# EAGLE design ScouseTom_CS_Shield (EAGLE 9.4.2)

## Sheet 1 of 5: Arduino
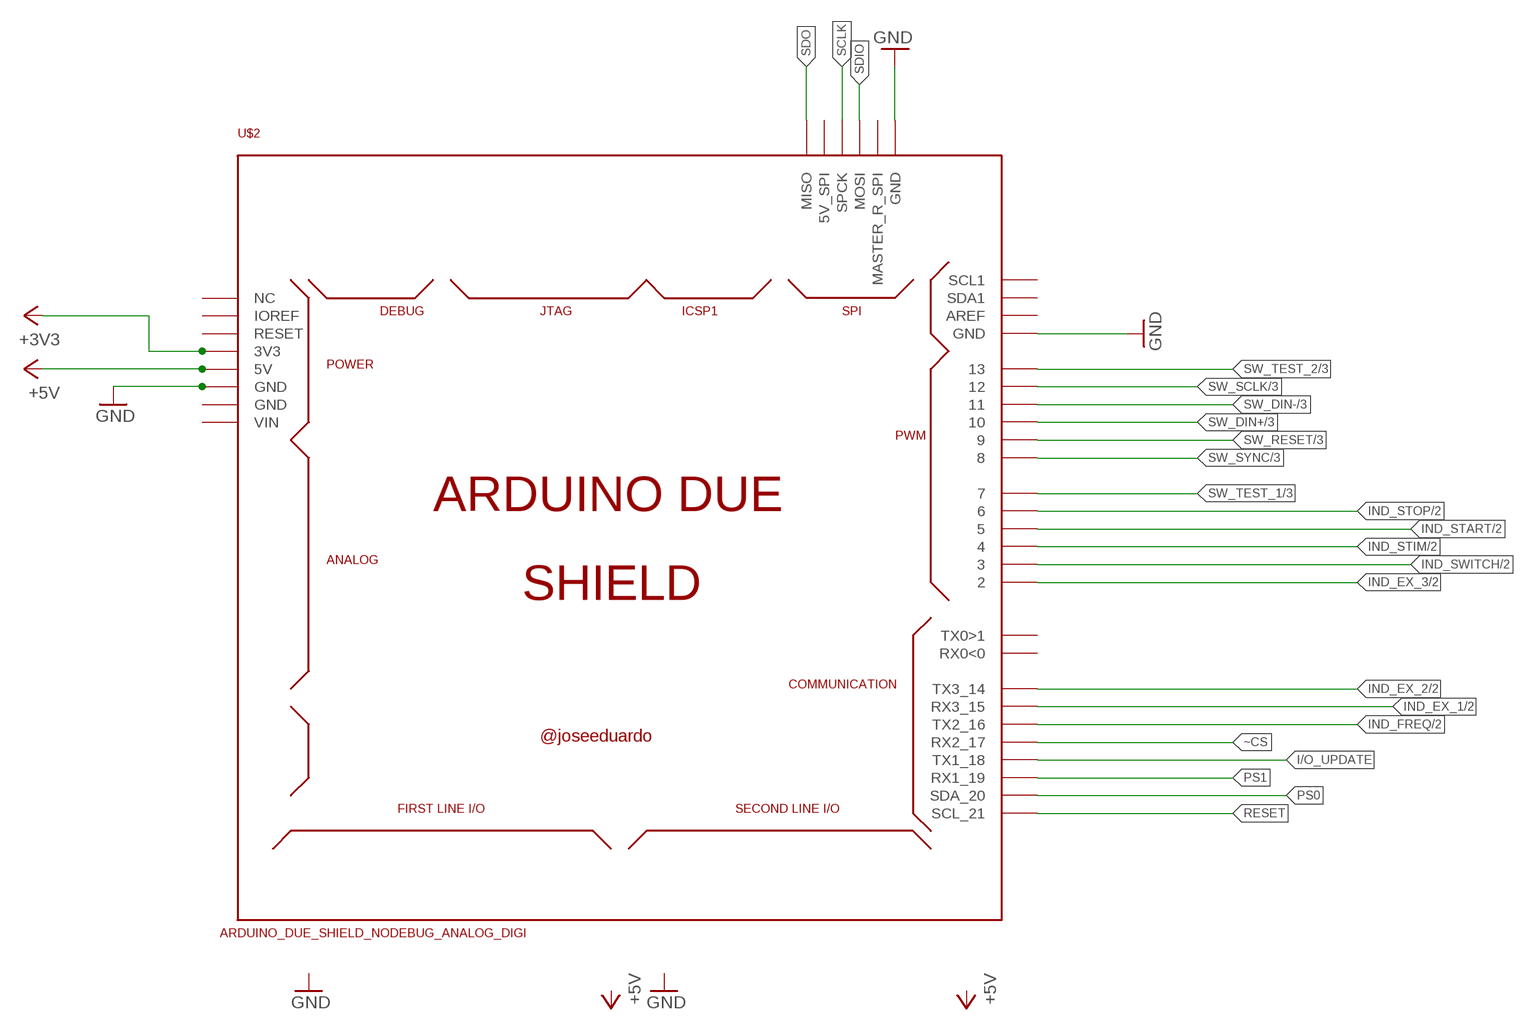
[diagram p0: schematic, sheet 1]

### Parts
U$2  ARDUINO_DUE_SHIELD_NODEBUG_ANALOG_DIGI  [ARDUINO_DUE_SHIELD_NODEBUG_ANALOG_DIG]

### Nets
+3V3: U$2.3V3 ; also sheet 4,5
+5V: U$2.5V0(5V) ; also sheet 2,3
GND: U$2.GND U$2.GND_4(GND) U$2.GND_5(GND) ; also sheet 2,3,4,5
I/O_UPDATE: U$2.18(TX1_18) ; also sheet 5
IND_EX_1: U$2.15(RX3_15) ; also sheet 2
IND_EX_2: U$2.14(TX3_14) ; also sheet 2
IND_EX_3: U$2.2 ; also sheet 2
IND_FREQ: U$2.16(TX2_16) ; also sheet 2
IND_START: U$2.5 ; also sheet 2
IND_STIM: U$2.4 ; also sheet 2
IND_STOP: U$2.6 ; also sheet 2
IND_SWITCH: U$2.3 ; also sheet 2
PS0: U$2.20(SDA_20) ; also sheet 5
PS1: U$2.19(RX1_19) ; also sheet 5
RESET: U$2.21(SCL_21) ; also sheet 5
SCLK: U$2.SPCK ; also sheet 4,5
SDIO: U$2.MOSI ; also sheet 4,5
SDO: U$2.MISO ; also sheet 4,5
SW_DIN+: U$2.10 ; also sheet 3
SW_DIN-: U$2.11 ; also sheet 3
SW_RESET: U$2.9 ; also sheet 3
SW_SCLK: U$2.12 ; also sheet 3
SW_SYNC: U$2.8 ; also sheet 3
SW_TEST_1: U$2.7 ; also sheet 3
SW_TEST_2: U$2.13 ; also sheet 3
~CS: U$2.17(RX2_17) ; also sheet 5
Unconnected: U$2.0(RX0<0) U$2.1(TX0>1) U$2.5V_2(5V_SPI) U$2.AREF U$2.GND_1(GND) U$2.IOREF U$2.MASTER_RESET_SPI(MASTER_R_SPI) U$2.NC_2(NC) U$2.RESET U$2.SCL1 U$2.SDA1 U$2.VIN

## Sheet 2 of 5: Indicators
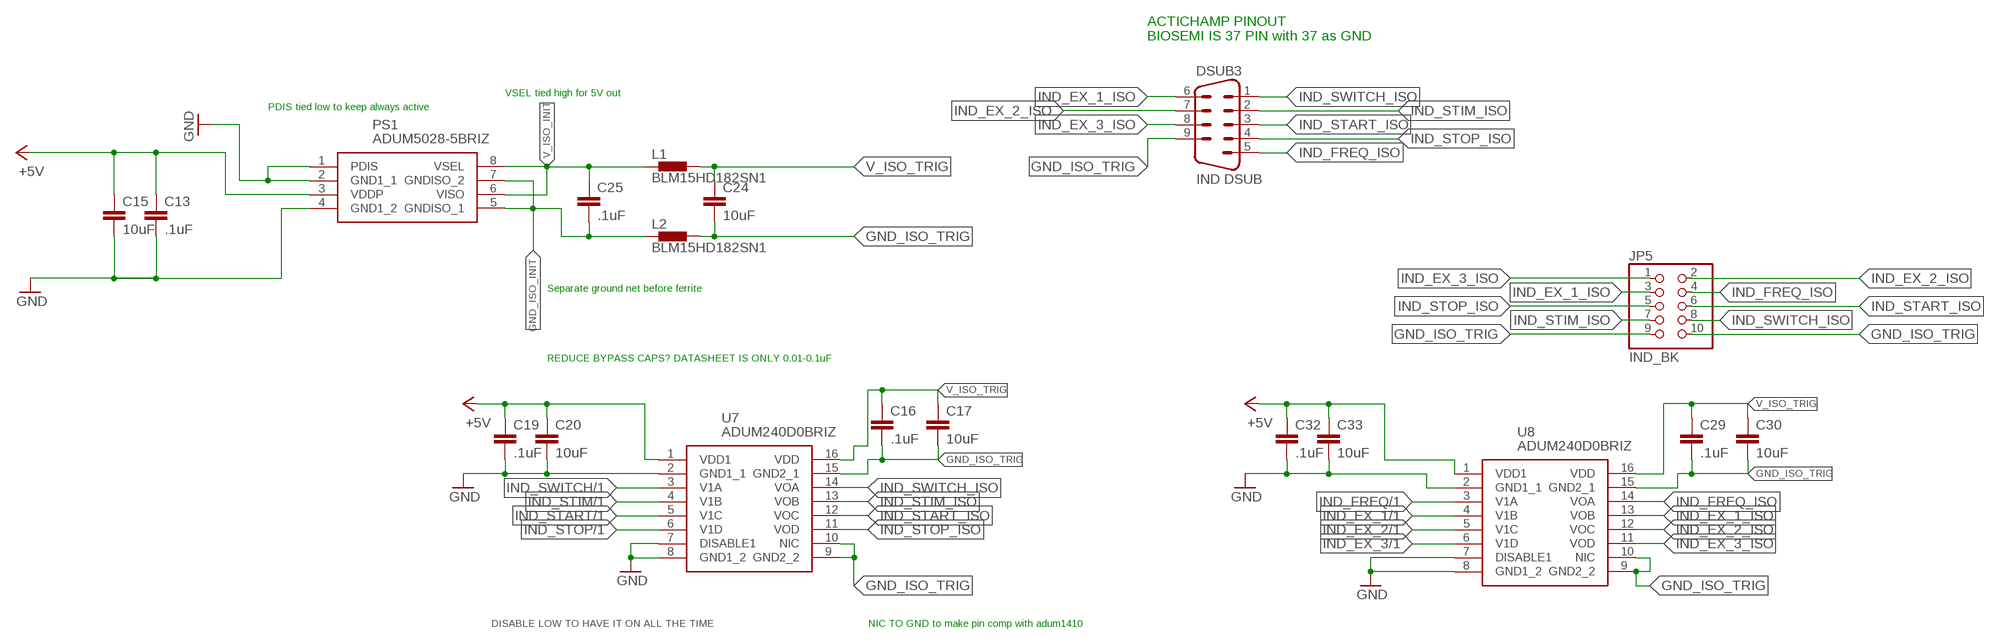
[diagram p1: schematic, sheet 2]

### Parts
C13  .1uF  C-EUC0603  [C0603]
C15  10uF  C-EUC0603  [C0603]
C16  .1uF  C-EUC0603  [C0603]
C17  10uF  C-EUC0603  [C0603]
C19  .1uF  C-EUC0603  [C0603]
C20  10uF  C-EUC0603  [C0603]
C24  10uF  C-EUC0603  [C0603]
C25  .1uF  C-EUC0603  [C0603]
C29  .1uF  C-EUC0603  [C0603]
C30  10uF  C-EUC0603  [C0603]
C32  .1uF  C-EUC0603  [C0603]
C33  10uF  C-EUC0603  [C0603]
DSUB3  IND DSUB  DSUB9RA  [DSUB9]
JP5  IND_BK  PINHD-2X5  [2X05]
L1  BLM15HD182SN1  [0402]
L2  BLM15HD182SN1  [0402]
PS1  ADUM5028-5BRIZ  [SOIC127P1031X265-8N]
U7  ADUM240D0BRIZ  [SOIC127P1032X265-16N]
U8  ADUM240D0BRIZ  [SOIC127P1032X265-16N]

### Nets
+5V: C13.1 C15.1 C19.1 C20.1 C32.1 C33.1 PS1.3(VDDP) U7.1(VDD1) U8.1(VDD1) ; also sheet 1,3
GND: C13.2 C15.2 C19.2 C20.2 C32.2 C33.2 PS1.1(PDIS) PS1.2(GND1_1) PS1.4(GND1_2) U7.2(GND1_1) U7.7(DISABLE1) U7.8(GND1_2) U8.2(GND1_1) U8.7(DISABLE1) U8.8(GND1_2) ; also sheet 1,3,4,5
GND_ISO_INIT: C25.2 L2.1 PS1.5(GNDISO_1) PS1.7(GNDISO_2)
GND_ISO_TRIG: C16.2 C17.2 C24.2 C29.2 C30.2 DSUB3.9 JP5.9 JP5.10 L2.2 U7.9(GND2_2) U7.10(NIC) U7.15(GND2_1) U8.9(GND2_2) U8.10(NIC) U8.15(GND2_1)
IND_EX_1: U8.4(V1B) ; also sheet 1
IND_EX_1_ISO: DSUB3.6 JP5.3 U8.13(VOB)
IND_EX_2: U8.5(V1C) ; also sheet 1
IND_EX_2_ISO: DSUB3.7 JP5.2 U8.12(VOC)
IND_EX_3: U8.6(V1D) ; also sheet 1
IND_EX_3_ISO: DSUB3.8 JP5.1 U8.11(VOD)
IND_FREQ: U8.3(V1A) ; also sheet 1
IND_FREQ_ISO: DSUB3.5 JP5.4 U8.14(VOA)
IND_START: U7.5(V1C) ; also sheet 1
IND_START_ISO: DSUB3.3 JP5.6 U7.12(VOC)
IND_STIM: U7.4(V1B) ; also sheet 1
IND_STIM_ISO: DSUB3.2 JP5.7 U7.13(VOB)
IND_STOP: U7.6(V1D) ; also sheet 1
IND_STOP_ISO: DSUB3.4 JP5.5 U7.11(VOD)
IND_SWITCH: U7.3(V1A) ; also sheet 1
IND_SWITCH_ISO: DSUB3.1 JP5.8 U7.14(VOA)
V_ISO_INIT: C25.1 L1.1 PS1.6(VISO) PS1.8(VSEL)
V_ISO_TRIG: C16.1 C17.1 C24.1 C29.1 C30.1 L1.2 U7.16(VDD) U8.16(VDD)

### Notes on the sheet
- ACTICHAMP PINOUT
  BIOSEMI IS 37 PIN with 37 as GND
- VSEL tied high for 5V out
- PDIS tied low to keep always active
- Separate ground net before ferrite
- REDUCE BYPASS CAPS? DATASHEET IS ONLY 0.01-0.1uF
- DISABLE LOW TO HAVE IT ON ALL THE TIME | NIC TO GND to make pin comp with adum1410

## Sheet 3 of 5: Switch
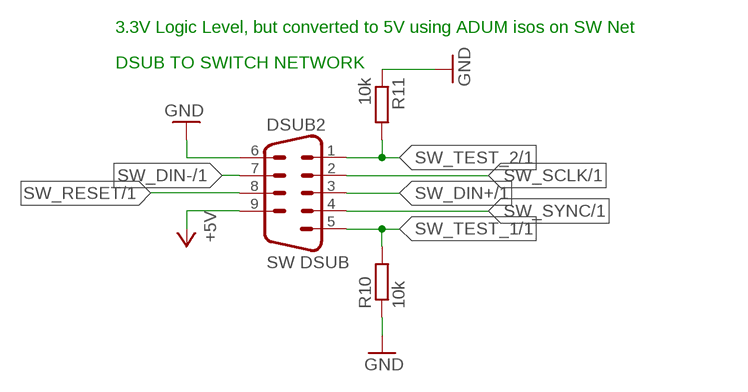
[diagram p2: schematic, sheet 3]

### Parts
DSUB2  SW DSUB  DSUB9RA  [DSUB9]
R10  10k  R-EU_R0805  [R0805]
R11  10k  R-EU_R0805  [R0805]

### Nets
+5V: DSUB2.9 ; also sheet 1,2
GND: DSUB2.6 R10.1 R11.1 ; also sheet 1,2,4,5
SW_DIN+: DSUB2.3 ; also sheet 1
SW_DIN-: DSUB2.7 ; also sheet 1
SW_RESET: DSUB2.8 ; also sheet 1
SW_SCLK: DSUB2.2 ; also sheet 1
SW_SYNC: DSUB2.4 ; also sheet 1
SW_TEST_1: DSUB2.5 R10.2 ; also sheet 1
SW_TEST_2: DSUB2.1 R11.2 ; also sheet 1

### Notes on the sheet
- 3.3V Logic Level, but converted to 5V using ADUM isos on SW Net
- DSUB TO SWITCH NETWORK

## Sheet 4 of 5: AD99554 Power and Clock
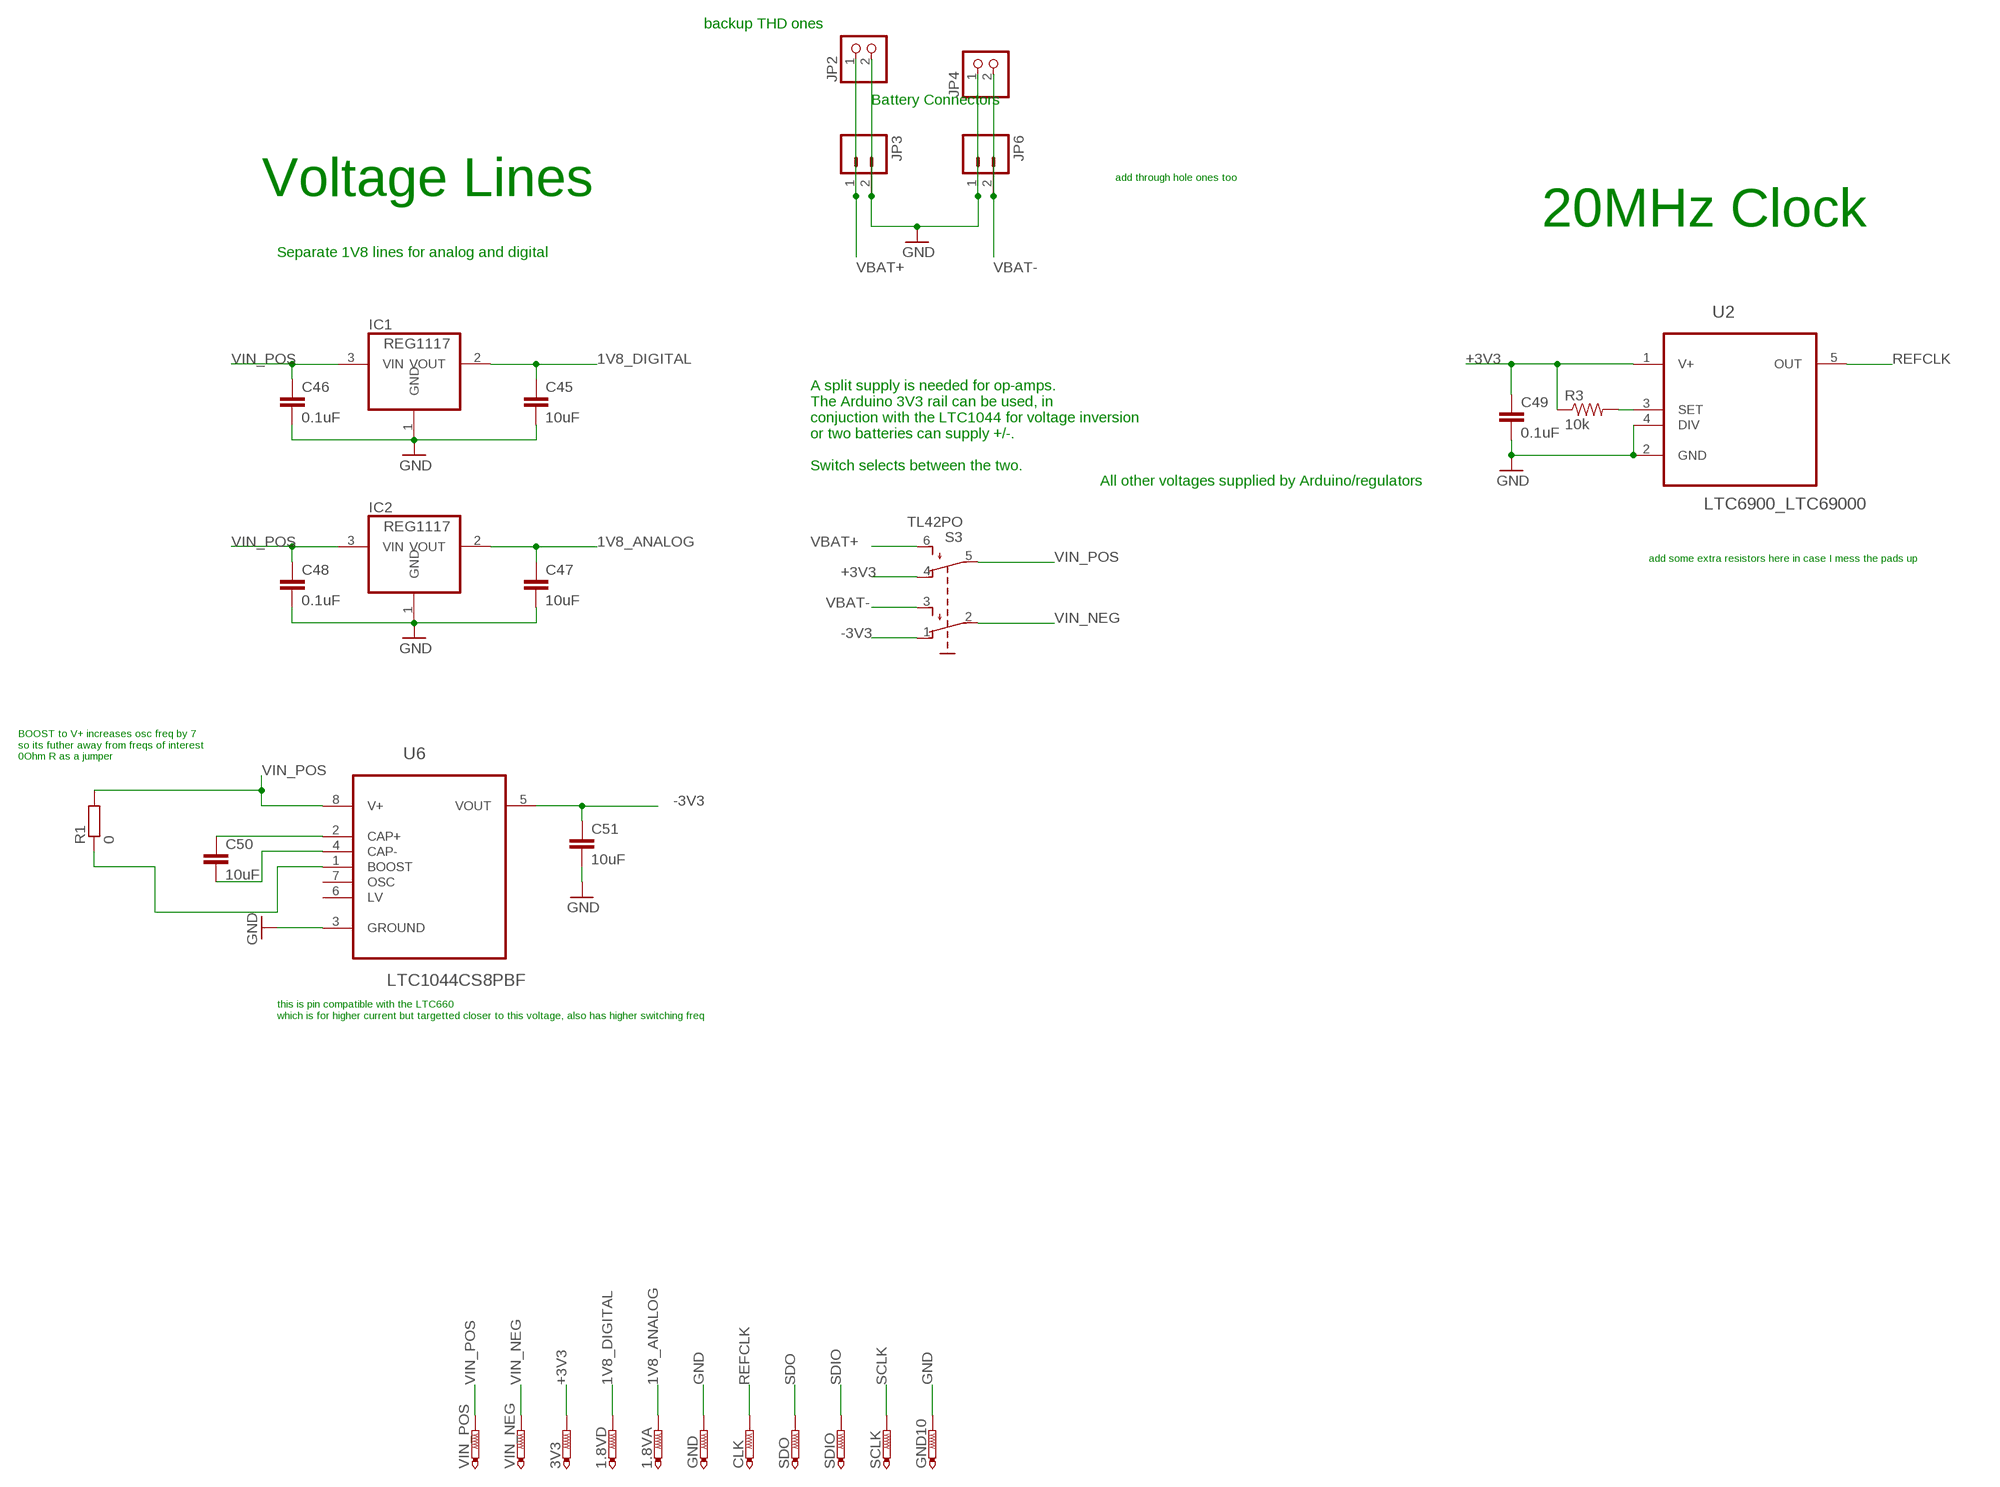
[diagram p3: schematic, sheet 4]

### Parts
1.8VA  PTR1PAD1-13  [P1-13]
1.8VD  PTR1PAD1-13  [P1-13]
3V3  PTR1PAD1-13  [P1-13]
C45  10uF  C-EUC0603  [C0603]
C46  0.1uF  C-EUC0603  [C0603]
C47  10uF  C-EUC0603  [C0603]
C48  0.1uF  C-EUC0603  [C0603]
C49  0.1uF  C-EUC0603  [C0603]
C50  10uF  C-EUC0603  [C0603]
C51  10uF  C-EUC0603  [C0603]
CLK  PTR1PAD1-13  [P1-13]
GND  PTR1PAD1-13  [P1-13]
GND10  PTR1PAD1-13  [P1-13]
IC1  REG1117  [SOT223]
IC2  REG1117  [SOT223]
JP2  PINHD-1X2  [1X02]
JP3  M02-JST-2MM-SMT  [JST-2-SMD]
JP4  PINHD-1X2  [1X02]
JP6  M02-JST-2MM-SMT  [JST-2-SMD]
R1  0  R-EU_R0805  [R0805]
R3  10k  R-US_R0805  [R0805]
S3  TL42PO  [TL4XPO]
SCLK  PTR1PAD1-13  [P1-13]
SDIO  PTR1PAD1-13  [P1-13]
SDO  PTR1PAD1-13  [P1-13]
U2  LTC6900_LTC69000  [LTC6900_SOT23-5L]
U6  LTC1044CS8PBF  [SOIC127P600X175-8N]
VIN_NEG  PTR1PAD1-13  [P1-13]
VIN_POS  PTR1PAD1-13  [P1-13]

### Nets
1V8_ANALOG: 1.8VA.TP C47.1 IC2.2(VOUT) ; also sheet 5
1V8_DIGITAL: 1.8VD.TP C45.1 IC1.2(VOUT) ; also sheet 5
+3V3: 3V3.TP C49.1 R3.1 S3.4(O1) U2.1(V+) ; also sheet 1,5
-3V3: C51.1 S3.1(O) U6.5(VOUT)
GND: C45.2 C46.2 C47.2 C48.2 C49.2 C51.2 GND10.TP GND.TP IC1.1(GND) IC2.1(GND) JP2.2 JP3.2 JP4.1 JP6.1 U2.2(GND) U2.4(DIV) U6.3(GROUND) ; also sheet 1,2,3,5
N$3: R1.1 U6.1(BOOST)
N$12: C50.1 U6.2(CAP+)
N$13: R3.2 U2.3(SET)
N$14: C50.2 U6.4(CAP-)
REFCLK: CLK.TP U2.5(OUT) ; also sheet 5
SCLK: SCLK.TP ; also sheet 1,5
SDIO: SDIO.TP ; also sheet 1,5
SDO: SDO.TP ; also sheet 1,5
VBAT+: JP2.1 JP3.1 S3.6(S1)
VBAT-: JP4.2 JP6.2 S3.3(S)
VIN_NEG: S3.2(P) VIN_NEG.TP ; also sheet 5
VIN_POS: C46.1 C48.1 IC1.3(VIN) IC2.3(VIN) R1.2 S3.5(P1) U6.8(V+) VIN_POS.TP ; also sheet 5
Unconnected: U6.6(LV) U6.7(OSC)

### Notes on the sheet
- backup THD ones
- Battery Connectors
- add through hole ones too
- Voltage Lines
- 20MHz Clock
- Separate 1V8 lines for analog and digital
- A split supply is needed for op-amps.
  The Arduino 3V3 rail can be used, in 
  conjuction with the LTC1044 for voltage inversion
  or two batteries can supply +/-.
  
  Switch selects between the two.
- All other voltages supplied by Arduino/regulators
- add some extra resistors here in case I mess the pads up
- BOOST to V+ increases osc freq by 7
  so its futher away from freqs of interest
  0Ohm R as a jumper
- this is pin compatible with the LTC660
  which is for higher current but targetted closer to this voltage, also has higher switching freq

## Sheet 5 of 5: DAC and HCP
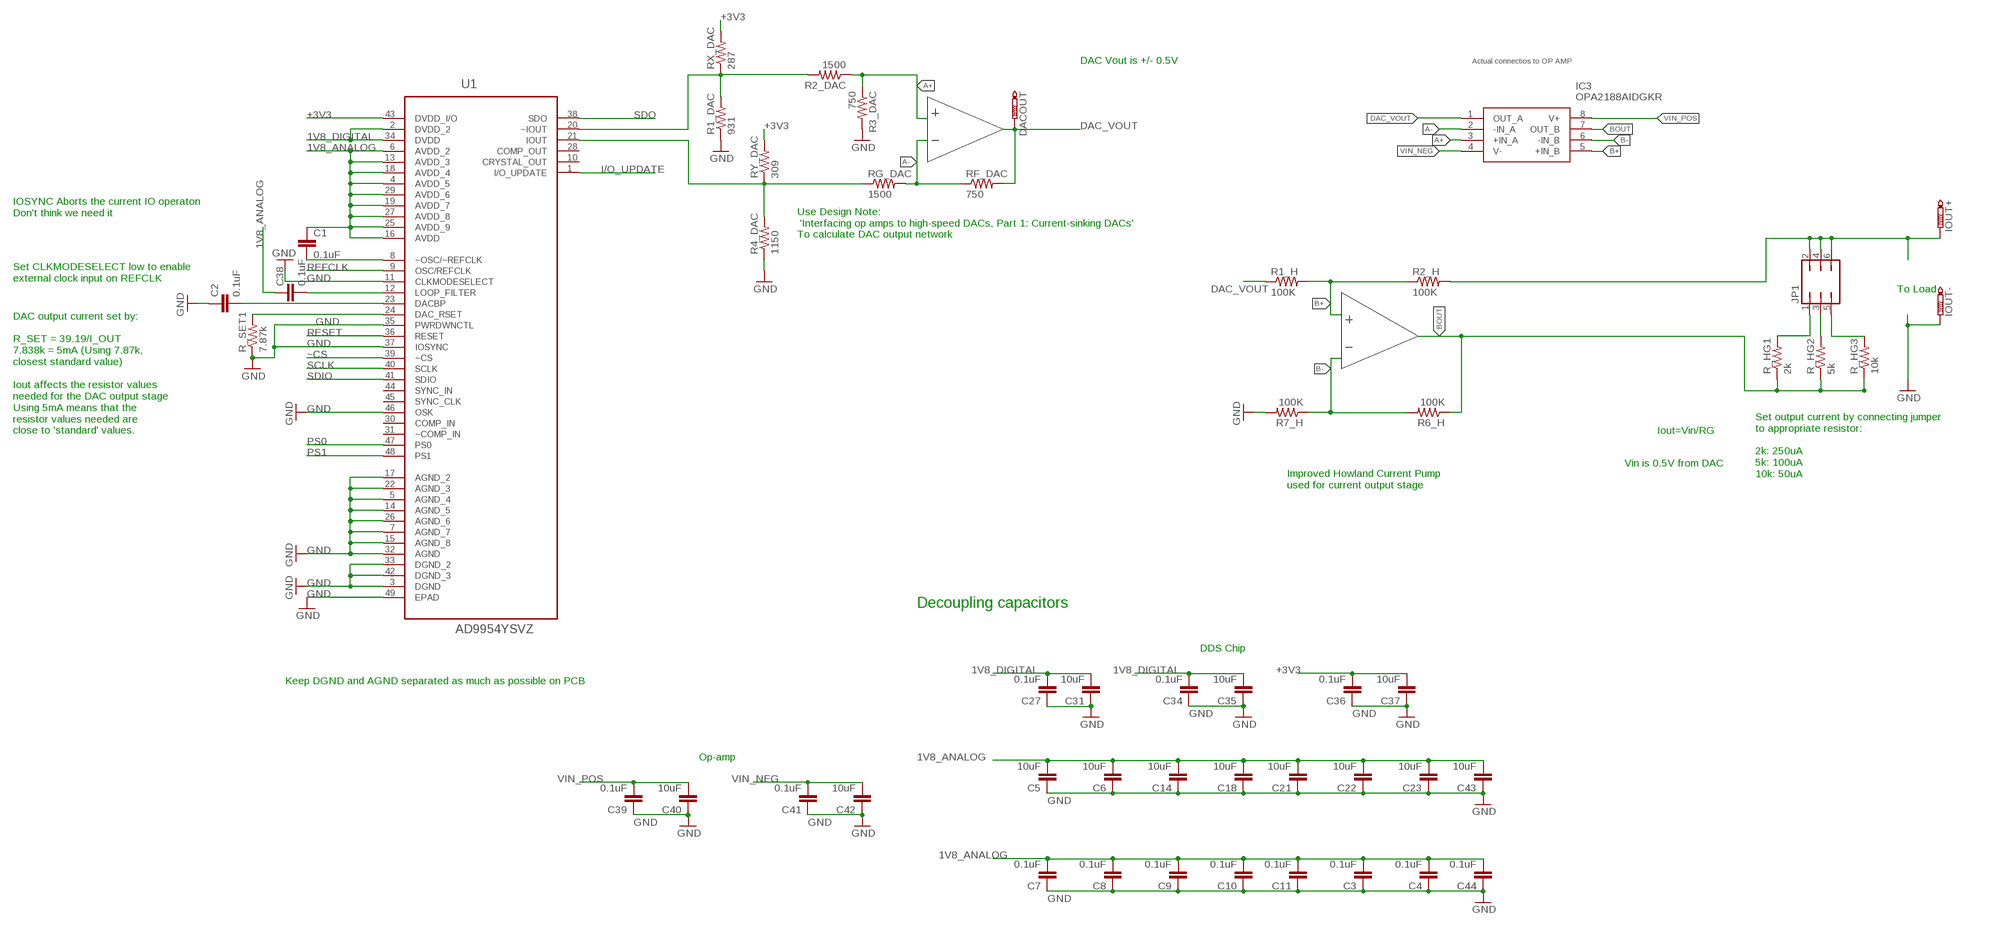
[diagram p4: schematic, sheet 5]

### Parts
C1  0.1uF  C-EUC0603  [C0603]
C2  0.1uF  C-EUC0603  [C0603]
C3  0.1uF  C-EUC0603  [C0603]
C4  0.1uF  C-EUC0603  [C0603]
C5  10uF  C-EUC0603  [C0603]
C6  10uF  C-EUC0603  [C0603]
C7  0.1uF  C-EUC0603  [C0603]
C8  0.1uF  C-EUC0603  [C0603]
C9  0.1uF  C-EUC0603  [C0603]
C10  0.1uF  C-EUC0603  [C0603]
C11  0.1uF  C-EUC0603  [C0603]
C14  10uF  C-EUC0603  [C0603]
C18  10uF  C-EUC0603  [C0603]
C21  10uF  C-EUC0603  [C0603]
C22  10uF  C-EUC0603  [C0603]
C23  10uF  C-EUC0603  [C0603]
C27  0.1uF  C-EUC0603  [C0603]
C31  10uF  C-EUC0603  [C0603]
C34  0.1uF  C-EUC0603  [C0603]
C35  10uF  C-EUC0603  [C0603]
C36  0.1uF  C-EUC0603  [C0603]
C37  10uF  C-EUC0603  [C0603]
C38  0.1uF  C-EUC0603  [C0603]
C39  0.1uF  C-EUC0603  [C0603]
C40  10uF  C-EUC0603  [C0603]
C41  0.1uF  C-EUC0603  [C0603]
C42  10uF  C-EUC0603  [C0603]
C43  10uF  C-EUC0603  [C0603]
C44  0.1uF  C-EUC0603  [C0603]
DACOUT  PTR1PAD1-13  [P1-13]
IC3  OPA2188AIDGKR  [SOP65P490X110-8N]
IOUT+  PTR1PAD1-13  [P1-13]
IOUT-  PTR1PAD1-13  [P1-13]
JP1  JP3Q  [JP3Q]
R1_DAC  931  R-US_R0805  [R0805]
R1_H  100K  R-US_R0805  [R0805]
R2_DAC  1500  R-US_R0805  [R0805]
R2_H  100K  R-US_R0805  [R0805]
R3_DAC  750  R-US_R0805  [R0805]
R4_DAC  1150  R-US_R0805  [R0805]
R6_H  100K  R-US_R0805  [R0805]
R7_H  100K  R-US_R0805  [R0805]
R_HG1  2k  R-US_R0805  [R0805]
R_HG2  5k  R-US_R0805  [R0805]
R_HG3  10k  R-US_R0805  [R0805]
R_SET1  7.87k  R-US_R0805  [R0805]
RF_DAC  750  R-US_R0805  [R0805]
RG_DAC  1500  R-US_R0805  [R0805]
RX_DAC  287  R-US_R0805  [R0805]
RY_DAC  309  R-US_R0805  [R0805]
U1  AD9954YSVZ  [QFP50P900X900X120-49N]

### Nets
1V8_ANALOG: C1.1 C3.2 C4.2 C5.2 C6.2 C7.2 C8.2 C9.2 C10.2 C11.2 C14.2 C18.2 C21.2 C22.2 C23.2 C38.1 C43.2 C44.2 U1.4(AVDD_5) U1.6(AVDD_2) U1.13(AVDD_3) U1.16(AVDD) U1.18(AVDD_4) U1.19(AVDD_7) U1.25(AVDD_9) U1.27(AVDD_8) U1.29(AVDD_6) ; also sheet 4
1V8_DIGITAL: C27.2 C31.2 C34.2 C35.2 U1.2(DVDD_2) U1.34(DVDD) ; also sheet 4
+3V3: C36.2 C37.2 RX_DAC.2 RY_DAC.2 U1.43(DVDD_I/O) ; also sheet 1,4
A+: IC3.3(+IN_A) R2_DAC.1 R3_DAC.1
A-: IC3.2(-IN_A) RF_DAC.1 RG_DAC.2
B+: IC3.5(+IN_B) R1_H.2 R2_H.1
B-: IC3.6(-IN_B) R6_H.2 R7_H.1
BOUT: IC3.7(OUT_B) R6_H.1 R_HG1.1 R_HG2.1 R_HG3.1
DAC_VOUT: DACOUT.TP IC3.1(OUT_A) R1_H.1 RF_DAC.2
GND: C2.1 C3.1 C4.1 C5.1 C6.1 C7.1 C8.1 C9.1 C10.1 C11.1 C14.1 C18.1 C21.1 C22.1 C23.1 C27.1 C31.1 C34.1 C35.1 C36.1 C37.1 C39.1 C40.1 C41.1 C42.1 C43.1 C44.1 IOUT-.TP R1_DAC.1 R3_DAC.2 R4_DAC.1 R7_H.2 R_SET1.1 U1.3(DGND) U1.5(AGND_4) U1.7(AGND_7) U1.11(CLKMODESELECT) U1.14(AGND_5) U1.15(AGND_8) U1.17(AGND_2) U1.22(AGND_3) U1.26(AGND_6) U1.32(AGND) U1.33(DGND_2) U1.35(PWRDWNCTL) U1.37(IOSYNC) U1.42(DGND_3) U1.46(OSK) U1.49(EPAD) ; also sheet 1,2,3,4
I/O_UPDATE: U1.1(I/O_UPDATE) ; also sheet 1
IOUT: R4_DAC.2 RG_DAC.1 RY_DAC.1 U1.21(IOUT)
N$1: C2.2 U1.23(DACBP)
N$2: C1.2 U1.8(~OSC/~REFCLK)
N$4: R_SET1.2 U1.24(DAC_RSET)
N$10: C38.2 U1.12(LOOP_FILTER)
N$11: IOUT+.TP JP1.2 JP1.4 JP1.6 R2_H.2
N$18: JP1.3 R_HG2.2
N$20: JP1.5 R_HG3.2
N$21: JP1.1 R_HG1.2
PS0: U1.47(PS0) ; also sheet 1
PS1: U1.48(PS1) ; also sheet 1
REFCLK: U1.9(OSC/REFCLK) ; also sheet 4
RESET: U1.36(RESET) ; also sheet 1
SCLK: U1.40(SCLK) ; also sheet 1,4
SDIO: U1.41(SDIO) ; also sheet 1,4
SDO: U1.38(SDO) ; also sheet 1,4
VIN_NEG: C41.2 C42.2 IC3.4(V-) ; also sheet 4
VIN_POS: C39.2 C40.2 IC3.8(V+) ; also sheet 4
~CS: U1.39(~CS) ; also sheet 1
~IOUT: R1_DAC.2 R2_DAC.2 RX_DAC.1 U1.20(~IOUT)
Unconnected: U1.10(CRYSTAL_OUT) U1.28(COMP_OUT) U1.30(COMP_IN) U1.31(~COMP_IN) U1.44(SYNC_IN) U1.45(SYNC_CLK)

### Notes on the sheet
- DAC Vout is +/- 0.5V | Actual connectios to OP AMP
- IOSYNC Aborts the current IO operaton
  Don't think we need it
- Use Design Note:
   'Interfacing op amps to high-speed DACs, Part 1: Current-sinking DACs' 
  To calculate DAC output network
- Set CLKMODESELECT low to enable
  external clock input on REFCLK
- To Load
- DAC output current set by:
  
  R_SET = 39.19/I_OUT
  7.838k = 5mA (Using 7.87k,
  closest standard value)
  
  Iout affects the resistor values
  needed for the DAC output stage
  Using 5mA means that the
  resistor values needed are
  close to 'standard' values.
- Iout=Vin/RG
- Vin is 0.5V from DAC
- Set output current by connecting jumper
  to appropriate resistor:
  
  2k: 250uA
  5k: 100uA
  10k: 50uA
- Improved Howland Current Pump
  used for current output stage
- Decoupling capacitors
- DDS Chip
- Keep DGND and AGND separated as much as possible on PCB
- Op-amp

## Library data of the parts
1.8VA 1.8VD 3V3 CLK DACOUT GND GND10 IOUT+ IOUT- SCLK SDIO SDO VIN_NEG VIN_POS = testpad:PTR1: TEST PIN
C1-C11 C13-C25 C27 C29-C51 = resistor:C-EU: CAPACITOR, European symbol
DSUB2 = DSUBJAMES:DSUB9RA
DSUB3 = ScouseTom_New:DSUB9RA
IC1 IC2 = burr-brown:REG1117: 800mA and 1A Low Dropout (LDO) Positive Regulator 1.8V, 2.5V, 2.85V, 3.3V, 5V, and Adj; MPN: REG1117; OC_FARNELL: 1097566; OC_NEWARK: 14P6981
IC3 = OPA2188AIDGKR:OPA2188AIDGKR: 0.03V/C, 6V Vos, Low Noise, Rail-to-Rail Output, 36V Zero-Drift Operational Amplifier Source: Datasheet <http://www.ti.com/lit/gpn/opa2188>; DESCRIPTION: 0.03V/C, 6V Vos, Low Noise, Rail-to-Rail Output, 36V Zero-Drift Operational Amplifier; HEIGHT: 1.1mm; MANUFACTURER_NAME: Texas Instruments; MANUFACTURER_PART_NUMBER: OPA2188AIDGKR
JP1 = jumper:JP3Q: JUMPER
JP2 JP4 = pinhead:PINHD-1X2: PIN HEADER
JP3 JP6 = SwitchBoard:M02: Header 2 Standard 2-pin 0.1" header. Use with straight break away headers (SKU : PRT-00116), right angle break away headers (PRT-00553), swiss pins (PRT-00743), machine pins (PRT-00117), and female headers (PRT-00115). Molex polarized connector foot print use with SKU : PRT-08233 with associated crimp pins and housings.
JP5 = pinhead:PINHD-2X5: PIN HEADER
L1 L2 = inductors:BLM15H: EMIFIL (R) Chip Ferrite Bead for GHz Noise Source: http://www.murata.com/ Ferrite Bead BLM15H.pdf
PS1 = ADUM5028-5BRIZ:ADUM5028-5BRIZ: Switching Voltage Regulators isoPower 3kV, Source: Datasheet <https://componentsearchengine.com/Datasheets/1/ADUM5028-5BRIZ.pdf>; DESCRIPTION: Switching Voltage Regulators isoPower 3kV,; HEIGHT: 2.65mm; MANUFACTURER_NAME: Analog Devices; MANUFACTURER_PART_NUMBER: ADUM5028-5BRIZ; MOUSER_PART_NUMBER: 584-ADUM5028-5BRIZ; MOUSER_PRICE-STOCK: https://www.mouser.com/Search/Refine.aspx?Keyword=584-ADUM5028-5BRIZ
R1 R10 R11 = resistor:R-EU_: RESISTOR, European symbol
R1_DAC R1_H R2_DAC R2_H R3 R3_DAC R4_DAC R6_H R7_H R_HG1-R_HG3 R_SET1 RF_DAC RG_DAC RX_DAC RY_DAC = adafruit:R-US_: RESISTOR, American symbol
S3 = switch:TL42PO: TINY SWITCH ON - MOM Source: http://www2.produktinfo.conrad.com/datenblaetter/700000-724999/705152-da-01-de-Subminiaturschalter_TL_36YO.pdf
U1 = AD9954:AD9954YSVZ: Direct Digital Synthesizer; MPN: AD9954YSVZ; OC_FARNELL: 1581969; OC_NEWARK: 19M8953; PACKAGE: TQFP-48; SUPPLIER: ANALOG DEVICES
U2 = Low.Noise.Current.Source:LTC6900_LTC69000: Low Power, 1kHz to 20MHz Resistor Set SOT-23 Oscillator
U6 = LTC_By_element14_Batch_1:LTC1044CS8PBF: Switched Capacitor Voltage Converter; MPN: LTC1044CS8#PBF; OC_FARNELL: 1663593; OC_NEWARK: 55M8900; PACKAGE: SOIC-8; SUPPLIER: Linear Technology
U7 U8 = ADUM240D0BRIZ:ADUM240D0BRIZ: Digital Isolator CMOS 4-CH 150Mbps 16-Pin SOIC W Tube Source: Datasheet <https://www.arrow.com/en/products/adum240d0briz/analog-devices>; DESCRIPTION: Digital Isolator CMOS 4-CH 150Mbps 16-Pin SOIC W Tube; HEIGHT: 2.65mm; MANUFACTURER_NAME: Analog Devices; MANUFACTURER_PART_NUMBER: ADUM240D0BRIZ
U$2 = arduino_due_shield:ARDUINO_DUE_SHIELD_NODEBUG_ANALOG_DIGI

## Board
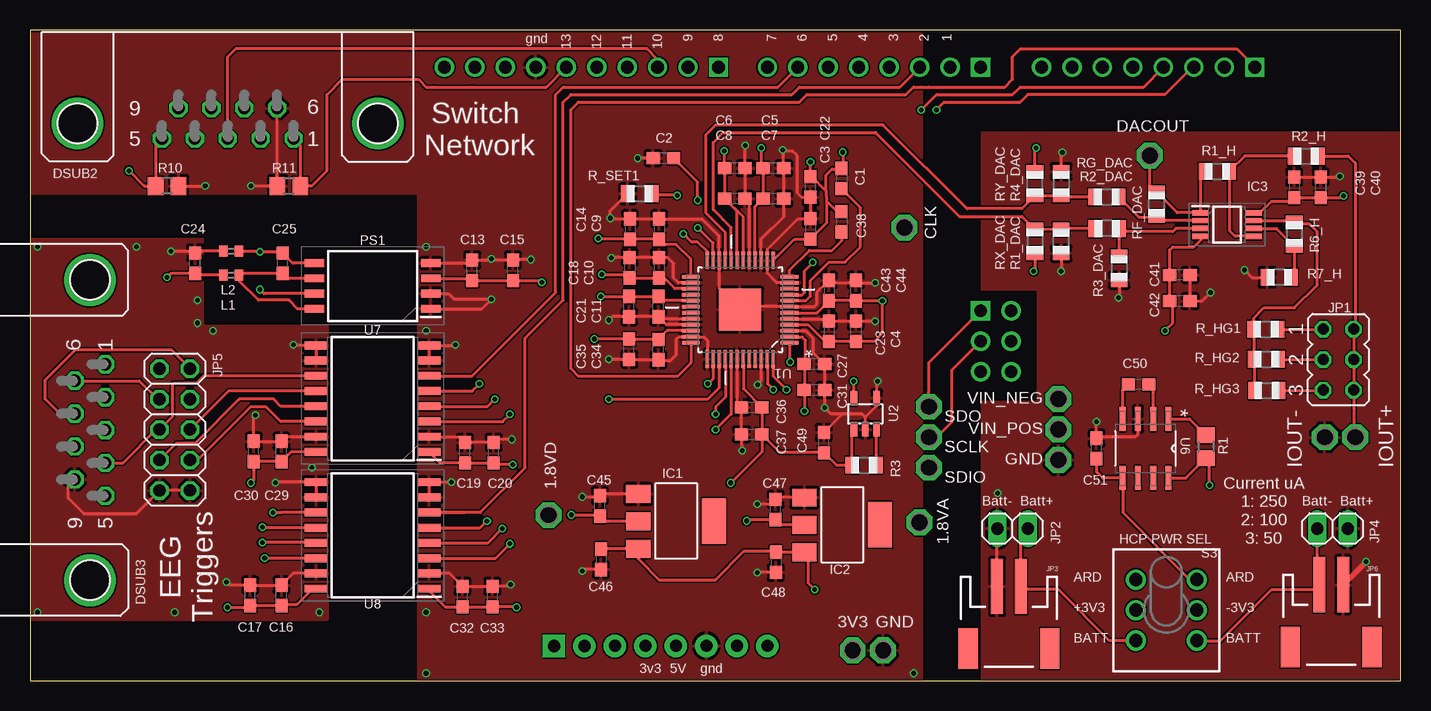
[diagram p5: board, top side]
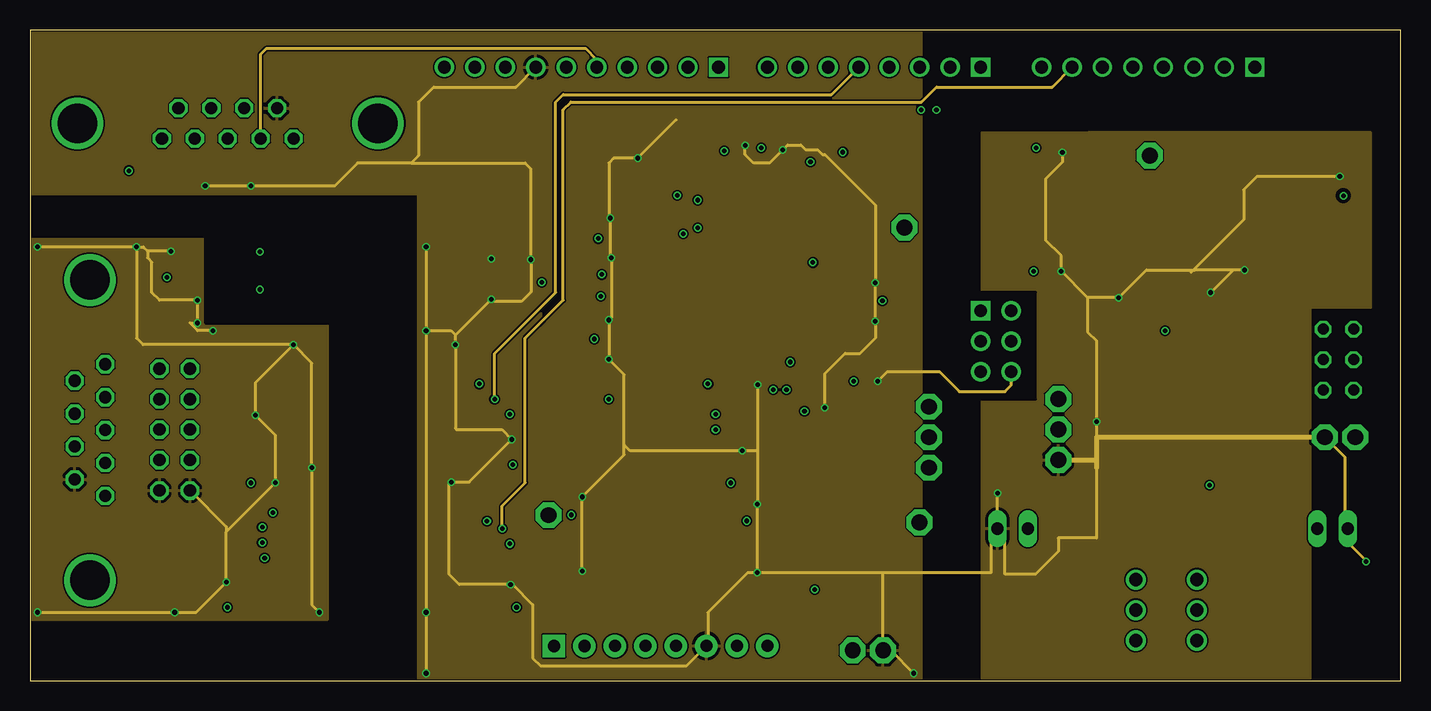
[diagram p6: board, inner layer Route2/GND]
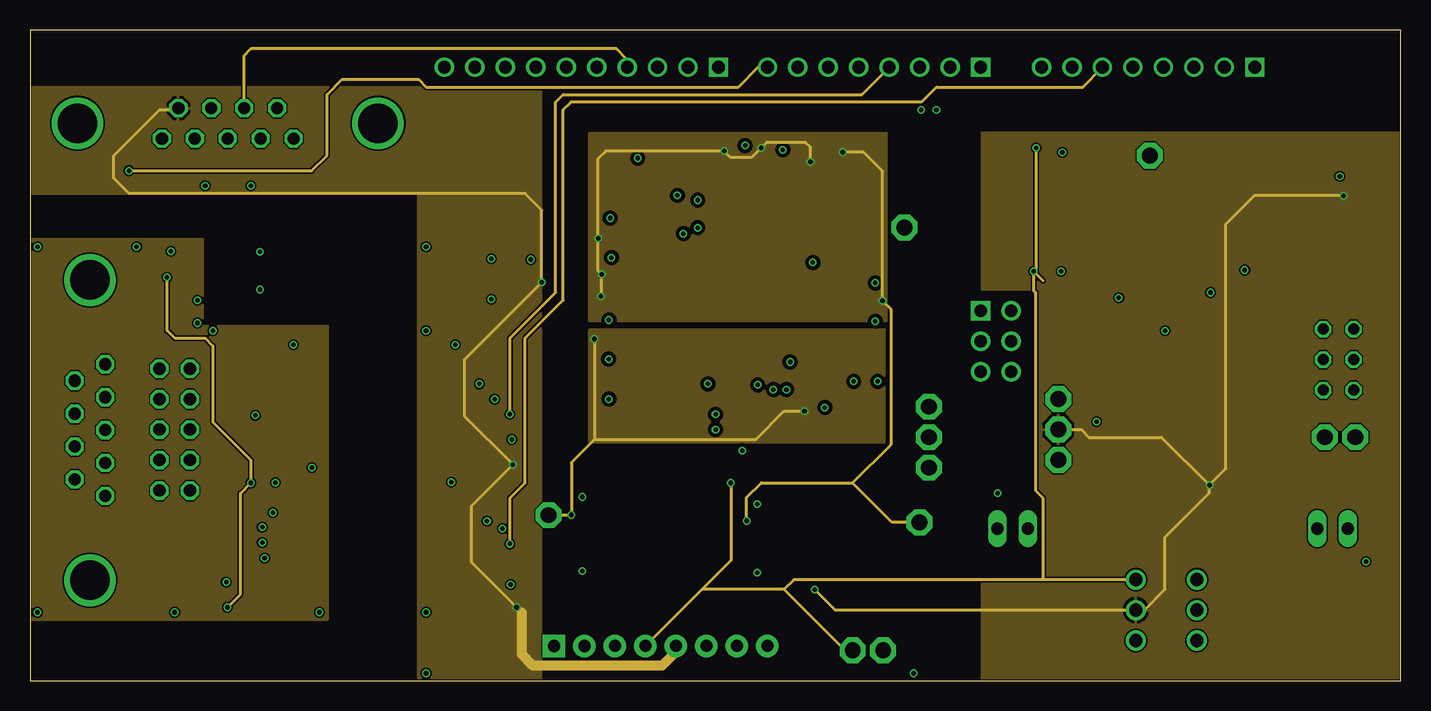
[diagram p7: board, inner layer Route15/VCC]
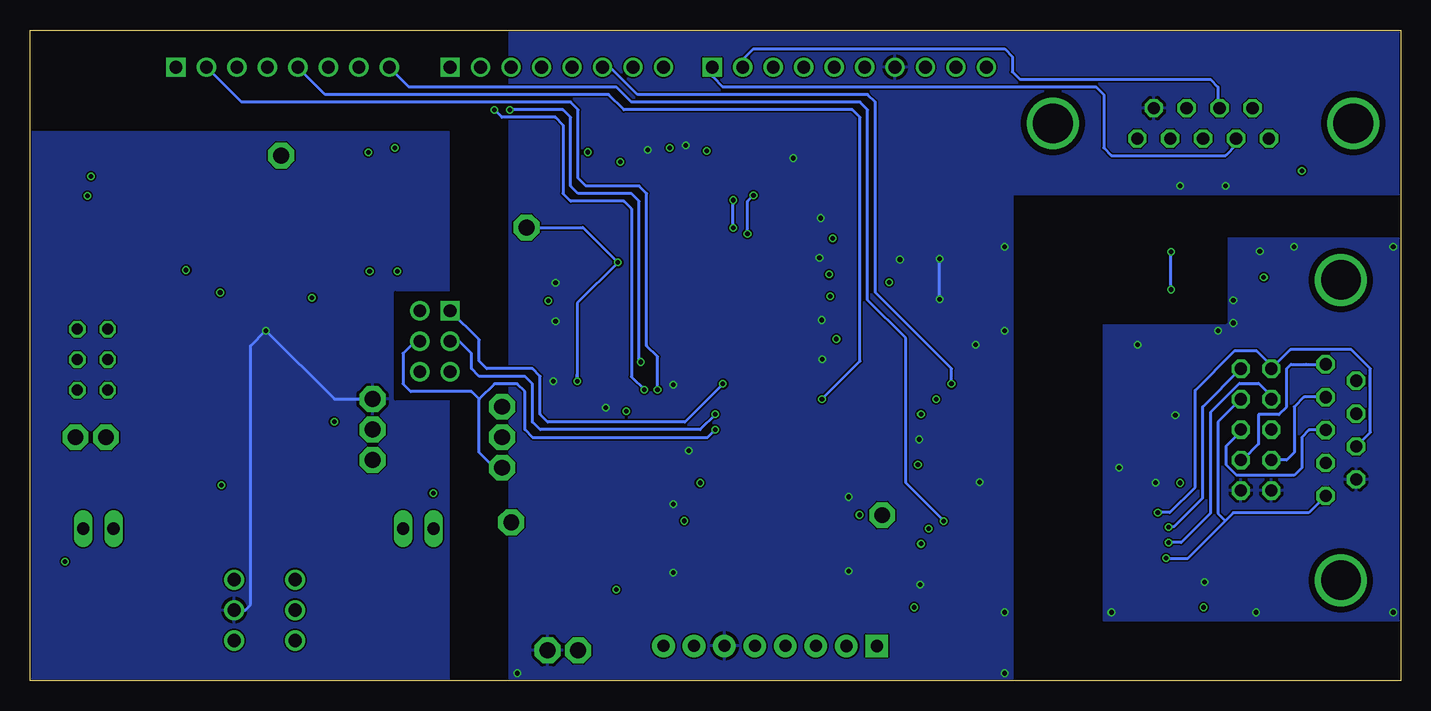
[diagram p8: board, bottom side, seen from below]

Size 114.28 x 54.28 mm. Coordinates in mm from the lower left corner, seen from the top.
Outline: 0,0 114.28,0 114.28,54.28 0,54.28 0,0
Copper layers (1*2*15*16): Top 0.035559375mm / dielectric 0.47751875mm / Route2/GND 0.035559375mm / dielectric 0.47751875mm / Route15/VCC 0.035559375mm / dielectric 0.47751875mm / Bottom 0.035559375mm
Design rules "SparkFun-4-layer-FAB-LIMIT": minimum track width 4mil, minimum drill 6mil, track to track 5mil, track to pad 5mil, pad to pad 5mil, via to via 5mil, smd to smd 5mil, copper to edge 4mil, drill to drill 4mil, minimum pad ring 5mil, minimum via ring 5mil, stop-mask expansion 4mil, vias tented up to drill 25mil, thermal gap 10mil

### Footprints (pad centres in the part's own frame; a part is rotated, then mirrored left to right if it is on the bottom)
P1-13 = drill 1.321 pad 2.159 octagon: TP 0,0
C0603 = smd 1.1 x 1: 1 -0.85,0; 2 0.85,0
DSUB9 = drill 1.016 octagon: 1 -5.486,0; 2 -2.743,0; 3 0,0; 4 2.743,0; 5 5.486,0; 6 -4.115,-2.54; 7 -1.372,-2.54; 8 1.372,-2.54; 9 4.115,-2.54 | drill 3.302: 10 -12.522,-1.27; 11 12.522,-1.27
SOT223 = smd 1.499 x 2.007: 1 -2.261,-3.15; 2 0.025,-3.15; 3 2.311,-3.15 | smd 3.81 x 2.007: 4 0,3.15
SOP65P490X110-8N = smd 1.4 x 0.45: 1 -2.2,0.975; 2 -2.2,0.325; 3 -2.2,-0.325; 4 -2.2,-0.975; 5 2.2,-0.975; 6 2.2,-0.325; 7 2.2,0.325; 8 2.2,0.975
JP3Q = drill 0.914 octagon: 1 -2.54,-1.27; 2 -2.54,1.27; 3 0,-1.27; 4 0,1.27; 5 2.54,-1.27; 6 2.54,1.27
1X02 = drill 1.016 long: 1 -1.27,0; 2 1.27,0
JST-2-SMD = smd 1 x 4.6: 1 -1,-3.7; 2 1,-3.7 | smd 1.6 x 3.4: NC1 -3.4,1.5; NC2 3.4,1.5
2X05 = drill 1.016 octagon: 1 -5.08,-1.27; 2 -5.08,1.27; 3 -2.54,-1.27; 4 -2.54,1.27; 5 0,-1.27; 6 0,1.27; 7 2.54,-1.27; 8 2.54,1.27; 9 5.08,-1.27; 10 5.08,1.27
0402 = smd 0.7 x 0.9: 1 -0.65,0; 2 0.65,0
SOIC127P1031X265-8N = smd 1.6 x 0.65: 1 -4.85,1.905; 2 -4.85,0.635; 3 -4.85,-0.635; 4 -4.85,-1.905; 5 4.85,-1.905; 6 4.85,-0.635; 7 4.85,0.635; 8 4.85,1.905
R0805 = smd 1.3 x 1.5: 1 -0.95,0; 2 0.95,0
R0805' = smd 1.1 x 1.4: 1 -1,0; 2 1,0
TL4XPO = drill 1.1 pad 1.676: 1 -2.54,2.54; 2 0,2.54; 3 2.54,2.54; 4 -2.54,-2.54; 5 0,-2.54; 6 2.54,-2.54
QFP50P900X900X120-49N = smd 1.473 x 0.279: 1 -4.115,2.743; 2 -4.115,2.261; 3 -4.115,1.753; 4 -4.115,1.245; 5 -4.115,0.762; 6 -4.115,0.254; 7 -4.115,-0.254; 8 -4.115,-0.762; 9 -4.115,-1.245; 10 -4.115,-1.753; 11 -4.115,-2.261; 12 -4.115,-2.743; 25 4.115,-2.743; 26 4.115,-2.261; 27 4.115,-1.753; 28 4.115,-1.245; 29 4.115,-0.762; 30 4.115,-0.254; 31 4.115,0.254; 32 4.115,0.762; 33 4.115,1.245; 34 4.115,1.753; 35 4.115,2.261; 36 4.115,2.743 | smd 0.279 x 1.473: 13 -2.743,-4.115; 14 -2.261,-4.115; 15 -1.753,-4.115; 16 -1.245,-4.115; 17 -0.762,-4.115; 18 -0.254,-4.115; 19 0.254,-4.115; 20 0.762,-4.115; 21 1.245,-4.115; 22 1.753,-4.115; 23 2.261,-4.115; 24 2.743,-4.115; 37 2.743,4.115; 38 2.261,4.115; 39 1.753,4.115; 40 1.245,4.115; 41 0.762,4.115; 42 0.254,4.115; 43 -0.254,4.115; 44 -0.762,4.115; 45 -1.245,4.115; 46 -1.753,4.115; 47 -2.261,4.115; 48 -2.743,4.115 | smd 3.505 x 3.505: 49 0,0
LTC6900_SOT23-5L = smd 0.55 x 1.2: 1 -0.95,-1.3; 2 0,-1.3; 3 0.95,-1.3; 4 0.95,1.3; 5 -0.95,1.3
SOIC127P600X175-8N = smd 1.981 x 0.533: 1 -2.464,1.905; 2 -2.464,0.635; 3 -2.464,-0.635; 4 -2.464,-1.905; 5 2.464,-1.905; 6 2.464,-0.635; 7 2.464,0.635; 8 2.464,1.905
SOIC127P1032X265-16N = smd 1.925 x 0.65: 1 -4.712,4.445; 2 -4.712,3.175; 3 -4.712,1.905; 4 -4.712,0.635; 5 -4.712,-0.635; 6 -4.712,-1.905; 7 -4.712,-3.175; 8 -4.712,-4.445; 9 4.712,-4.445; 10 4.712,-3.175; 11 4.712,-1.905; 12 4.712,-0.635; 13 4.712,0.635; 14 4.712,1.905; 15 4.712,3.175; 16 4.712,4.445
ARDUINO_DUE_SHIELD_NODEBUG_ANALOG_DIG = drill 1.067 square: 0 63.373,51.816; 8 41.529,51.816; 21 86.233,51.816; MISO 63.373,31.496 | drill 1.067: 1 60.833,51.816; 2 58.293,51.816; 3 55.753,51.816; 4 53.213,51.816; 5 50.673,51.816; 5V_2 65.913,31.496; 6 48.133,51.816; 7 45.593,51.816; 9 38.989,51.816; 10 36.449,51.816; 11 33.909,51.816; 12 31.369,51.816; 13 28.829,51.816; 14 68.453,51.816; 15 70.993,51.816; 16 73.533,51.816; 17 76.073,51.816; 18 78.613,51.816; 19 81.153,51.816; 20 83.693,51.816; AREF 23.749,51.816; GND_4 26.289,51.816; GND_5 65.913,26.416; MASTER_RESET_SPI 63.373,26.416; MOSI 65.913,28.956; SCL1 18.669,51.816; SDA1 21.209,51.816; SPCK 63.373,28.956 | drill 1.016 pad 1.88: 3V3 35.433,3.556; 5V0 37.973,3.556; GND 40.513,3.556; GND_1 43.053,3.556; IOREF 30.346,3.543; RESET 32.893,3.555; VIN 45.593,3.556 | drill 1.016 pad 1.88 square: NC_2 27.806,3.543

### Placement (x,y rotation side)
1.8VA  74.16,13.23 180 top
1.8VD  43.23,13.82 90 top
3V3  68.58,2.54 90 top
C1  67.67,41.89 270 top
C2  52.8,43.6 0 top
C3  65.06,37.69 270 top
C4  68.84,29.16 270 top
C5  61.98,42.75 180 top
C6  58.77,42.75 180 top
C7  61.98,40.21 180 top
C8  58.77,40.21 180 top
C9  52.45,37.68 270 top
C10  52.43,34.46 270 top
C11  52.38,31.22 90 top
C13  36.86,34.23 90 top
C14  50.01,37.68 270 top
C15  40.26,34.23 90 top
C16  20.96,7.13 90 top
C17  18.36,7.13 90 top
C18  49.98,34.46 270 top
C19  36.26,19.04 90 top
C20  38.66,19.04 90 top
C21  49.95,31.22 90 top
C22  65.06,41.19 90 top
C23  66.59,29.16 270 top
C24  13.76,34.84 90 top
C25  21.06,34.84 90 top
C27  65.39,26.41 180 top
C29  20.96,19.13 90 top
C30  18.66,19.13 90 top
C31  65.39,24.24 180 top
C32  36.06,7.04 90 top
C33  38.56,7.04 90 top
C34  52.39,27.62 90 top
C35  49.94,27.66 90 top
C36  60.16,22.82 0 top
C37  60.16,20.56 0 top
C38  67.67,38.29 270 top
C39  105.39,41.16 270 top
C40  107.59,41.16 270 top
C41  95.85,33.86 180 top
C42  95.85,31.66 180 top
C43  66.59,32.55 270 top
C44  68.84,32.55 270 top
C45  47.51,14.59 90 top
C46  47.59,10.13 270 top
C47  62.16,14.29 90 top
C48  62.17,9.89 270 top
C49  66.19,19.86 90 top
C50  92.42,24.73 180 top
C51  88.91,19.38 90 top
CLK  72.89,37.81 90 top
DACOUT  93.34,43.81 0 top
DSUB2  16.48,45.23 180 top
DSUB3  6.27,20.91 270 top
GND  71.12,2.54 0 top
GND10  85.72,18.41 0 top
IC1  53.86,13.32 270 top
IC2  67.71,13.02 270 top
IC3  99.78,38.06 0 top
IOUT+  110.49,20.32 270 top
IOUT-  107.95,20.32 270 top
JP1  109.07,26.79 270 top
JP2  81.92,12.7 180 top
JP3  81.61,4.19 180 top
JP4  108.59,12.7 180 top
JP5  12.06,20.95 270 top
JP6  108.47,4.33 180 top
L1  16.76,33.84 180 top
L2  16.76,35.84 180 top
PS1  28.56,32.94 180 top
R1  98.02,19.52 270 top
R1_DAC  931  [R0805']  85.97,36.66 90 top
R1_H  100K  [R0805']  98.98,42.49 0 top
R2_DAC  1500  [R0805']  89.78,37.73 180 top
R2_H  100K  [R0805']  106.39,43.76 0 top
R3  10k  [R0805']  69.53,17.99 0 top
R3_DAC  750  [R0805']  90.8,34.41 270 top
R4_DAC  1150  [R0805']  85.97,41.46 270 top
R6_H  100K  [R0805']  105.39,37.26 270 top
R7_H  100K  [R0805']  104.14,33.66 180 top
R10  11.43,41.27 180 top
R11  21.59,41.27 0 top
R_HG1  2k  [R0805']  103.03,29.31 0 top
R_HG2  5k  [R0805']  103.07,26.82 0 top
R_HG3  10k  [R0805']  103.11,24.21 0 top
R_SET1  7.87k  [R0805']  50.83,40.64 0 top
RF_DAC  750  [R0805']  93.92,39.76 90 top
RG_DAC  1500  [R0805']  89.77,40.36 0 top
RX_DAC  287  [R0805']  83.77,36.66 270 top
RY_DAC  309  [R0805']  83.77,41.46 90 top
S3  94.72,5.9 270 top
SCLK  74.93,20.32 0 top
SDIO  74.93,17.78 0 top
SDO  74.93,22.86 0 top
U1  59.2,30.95 180 top
U2  69.64,22.27 0 top
U6  92.99,19.38 270 top
U7  28.56,23.54 180 top
U8  28.56,12.13 180 top
U$2  15.88,-0.64 0 top
VIN_NEG  85.72,23.5 270 top
VIN_POS  85.72,20.95 270 top

### Tracks (layer width: path | path; a pad name or v marks a point on that pad's centre or on a via)
1V8_ANALOG  (via drill 0.38)
  Top 0.254: 66.36,40.85 66.36,40.39 66.42,40.39 66.42,40.01 | U1.19 58.95,39.17 C8.2 | U1.18 59.46,38.67 C8.2 | U1.29 52.74,31.71 C11.2 C21.2 v47.59,32.07 | U1.27 53.75,32.7 52.97,33.49 52.55,33.49 C10.2 C18.2 49.7,33.89 v47.66,33.89 | 66.39,28.1 C23.2 | U1.6 65.59,30.7 C43.2 C44.2 71.06,31.7 v71.06,31.69 71.06,28.99 70.39,28.31 C4.2 C23.2 | U1.4 64.85,29.7 66.06,28.49 66.42,28.49 C23.2 | 66.36,40.85 65.17,42.04 C22.2 v65.06,43.29 | U1.25 55.09,35.16 53.87,36.39 52.88,36.39 C9.2 C14.2 49.95,36.89 v47.37,36.89 | IC2.2 62.61,13 C47.1 59.84,13.44 v59.74,13.34 | v57.87,44.19 57.91,44.14 C6.2 C8.2 | 61.27,42.61 C5.2 | 66.36,40.85 66.36,42.19 66.86,42.69 67.61,42.69 C1.1 67.77,42.84 v67.77,44.09 | C5.2 60.96,42.91 v60.96,44.45 | U1.16 60.45,39.53 C7.2 C5.2 | C3.2 | U1.13 63.72,36.84 C3.2 | 66.42,40.01 66.42,38.19 C3.2 | C38.1 67.28,39.14 66.42,40.01
  Top 0.406: C3.2
  Route15/VCC 0.254: v65.06,43.29 65.06,44.49 64.66,44.89 61.4,44.89 v60.96,44.45 60.2,43.69 58.37,43.69 v57.87,44.19 48,44.19 47.37,43.55 v47.37,36.89 47.37,34.19 v47.66,33.89 47.66,32.15 v47.59,32.07 | v67.77,44.09 69.47,44.09 71.06,42.49 v71.06,31.69 71.75,31 71.75,19.68 68.58,16.51 | v59.74,13.34 59.74,15.29 60.96,16.51 68.58,16.51 | 1.8VA.TP 71.86,13.23 68.58,16.51
  pour Route15/VCC (isolate 0.305): 46.66,29.99 46.66,45.69 71.36,45.69 71.36,29.99
1V8_DIGITAL  (via drill 0.38)
  Top 0.254: 63.47,28.69 U1.2 64.37,28.69 64.66,28.39 64.66,26.53 C27.2 C31.2 64.55,22.51 v64.56,22.49 | IC1.2 47.95,13.3 C45.1 47.41,13.84 v45.13,13.84 | U1.34 53.11,29.2 C34.2 49.98,28.47 C35.2 v47.05,28.51
  Route15/VCC 0.254: v45.13,13.84 45.13,18.21 47.05,20.14 | v45.13,13.84 45.09,13.89 45.09,13.97 | 1.8VD.TP 43.26,13.84 v45.13,13.84 | v64.56,22.49 62.87,22.49 60.52,20.14 47.05,20.14 | v47.05,28.51 47.05,20.14
  pour Route15/VCC (isolate 0.305): 46.66,29.29 71.36,29.29 71.36,19.89 46.66,19.89
+3V3  (via drill 0.38)
  Top 0.254: U1.43 59.46,24.37 C36.2 C37.2 | U2.1 68.53,20.82 R3.1 67.21,17.99 C49.1 66.12,19.07 62.49,19.07 C37.2 | RY_DAC.2 83.77,44.36 v83.86,44.46 | RX_DAC.2 83.77,34.26 v83.67,34.16 | C37.2 61.01,19.09 v58.42,16.51
  Route15/VCC 0.254: v58.42,16.51 58.42,10.03 56.01,7.62 | 56.01,7.62 U$2.3V3 | S3.4 84.45,8.44 | 84.45,8.44 63.69,8.44 62.87,7.62 | 62.87,7.62 56.01,7.62 | v83.86,44.46 83.86,34.36 v83.67,34.16 | 3V3.TP 67.95,2.54 62.87,7.62 | v83.67,34.16 84.45,33.37 | v83.67,34.16 83.67,32.54 83.82,32.38 83.82,15.88 84.45,15.24 84.45,8.44
+5V  (via drill 0.38)
  Top 0.254: U8.1 33.27,7.52 34.61,6.19 C32.1 C33.1 40.41,6.19 40.51,6.08 v40.56,6.13 | 42.61,33.28 v42.66,33.23 42.51,33.38 C15.1 C13.1 36.68,33.57 PS1.3 | U7.1 34.18,18.18 C19.1 C20.1 38.81,18.04 v40.26,18.04
  Route15/VCC 0.254: DSUB2.9 12.23,47.62 10.79,47.62 6.99,43.81 6.99,41.91 8.25,40.64 41.27,40.64 42.66,39.26 v42.66,33.23 36.2,26.77 36.2,22.1 v40.26,18.04 36.83,14.61 36.83,9.87 v40.56,6.13 40.98,5.71
  Route15/VCC 0.813: 40.98,5.71 40.98,2.2 41.91,1.27 52.7,1.27 53.85,2.41 U$2.5V0
  pour Route15/VCC: 32.38,40.64 42.55,40.64 42.55,-0.64 32.38,-0.64
  pour Route15/VCC: 0,49.53 42.55,49.53 42.55,40.64 0,40.64
-3V3
  Top 0.254: C51.1 88.92,18.52 88.92,17.43 89.42,16.92 U6.5 91.09,14.06 96.7,8.44 S3.1
A+
  Top 0.254: R3_DAC.1 R2_DAC.1 | 91.09,37.42 R2_DAC.1 | IC3.3 95.52,37.73 95.25,37.46 91.05,37.46 R2_DAC.1
A-
  Top 0.254: RG_DAC.2 92.43,38.7 93.34,38.7 | 93.98,38.7 RF_DAC.1 93.86,38.7 93.34,38.7 | IC3.2 93.34,38.38 93.34,38.7
B+
  Top 0.254: R2_H.1 101.25,43.76 R1_H.2 99.98,37.55 100.45,37.09 IC3.5
B-
  Top 0.254: R7_H.1 105.39,33.9 R6_H.2 103.91,37.73 IC3.6
BOUT
  Top 0.254: R_HG3.1 102.07,24.25 R_HG2.1 102.03,26.86 R_HG1.1 102.03,30.27 102.87,31.12 105.41,31.12 107.31,33.02 107.31,37.46 106.68,38.1 106.05,38.1 | 106.05,38.1 105.55,38.1 R6_H.1 | IC3.7 105.76,38.38 106.05,38.1
DAC_VOUT
  Top 0.254: 94.48,40.76 RF_DAC.2 | RF_DAC.2 93.34,41.34 DACOUT.TP | RF_DAC.2 95.64,39.03 IC3.1 97.59,42.09 R1_H.1
GND  (via drill 0.38)
  Top 0.254: PS1.2 34.9,32.3 35.36,31.84 v38.46,31.84 37.66,31.03 PS1.1 | v35.12,16.58 U8.8 U8.7 | v35.46,28.03 35.41,27.98 U7.8 U7.7 | v41.76,35.13 40.16,35.13 | 20.62,47.75 DSUB2.6 20.6,41.31 R11.1 v18.42,41.27 | C5.1 C7.1 62.87,40.17 62.87,38.73 60.96,36.83 U1.15 | U1.17 59.97,39.86 C8.1 C6.1 v59.62,44.64 | U1.42 58.95,23.17 C36.1 C37.1 59.37,20.5 v59.37,19.19 | C27.1 C31.1 66.27,24.22 v66.27,22.79 66.78,22.27 67.75,22.27 | 66.57,26.74 C27.1 | U1.37 56.46,28.39 56.17,28.69 U1.35 54.06,28.69 53.87,28.49 53.87,27.2 53.34,26.67 52.49,26.67 C34.1 52.35,26.81 C35.1 49.92,26.84 v48.24,26.84 | U1.33 53.05,29.7 C11.1 | U1.32 52.57,30.19 C11.1 | C11.1 C21.1 48.55,30.37 v48.27,30.09 | U1.26 54.04,33.21 53.66,33.59 53.66,34.79 53.16,35.29 52.45,35.29 C10.1 C18.1 48.48,35.31 v48.47,35.29 | C23.1 C4.1 70.45,30.01 v70.47,29.99 | C23.1 66.48,30.01 | U1.3 64.66,29.2 65.27,28.59 65.27,27.39 C27.1 | U1.5 66.42,30.19 C23.1 | U1.11 62.24,33.21 61.47,33.99 U1.14 61.47,35.99 64.02,38.54 C3.1 C22.1 64.31,40.34 63.97,40.69 63.97,43.79 63.56,44.19 62.87,44.19 v62.77,44.29 62.83,44.23 C5.1 | 62.83,42.68 C5.1 | 69.05,33.19 C44.1 | 69.05,33.19 66.81,33.19 C43.1 65.56,32.37 65.56,31.39 65.38,31.2 U1.7 59.46,31.2 U1.49 57.45,32.7 U1.22 57.45,37.1 56.02,38.53 C9.1 C14.1 48.43,38.53 v48.37,38.59 48.37,39.18 R_SET1.1 49.83,40.05 | 69.05,33.19 v70.47,33.19 | C2.1 50.68,43.6 v50.66,43.59 | U1.46 60.96,24.98 v60.66,24.69 | U2.2 69.64,22 | 69.64,22 69.36,22.27 67.75,22.27 | 67.75,22.27 C49.2 | 69.64,22 70.59,22.95 U2.4 70.59,24.89 v70.67,24.98 | IC1.1 47.65,15.59 C45.2 47.41,15.34 v46.03,15.34 | C46.2 46.17,9.29 v46.03,9.14
  Top 0.254: IC2.1 62.3,15.28 C47.2 61.76,14.74 v60.64,14.74 | C48.2 v60.64,9.04 | U6.3 92.36,20.56 92.12,20.32 89,20.32 C51.2 88.91,21.61 v88.92,21.62 | R4_DAC.1 85.97,43.96 v86.06,44.06 | R1_DAC.1 v85.97,34.16 | R3_DAC.2 90.8,31.99 v90.77,31.96 | C39.1 C40.1 109.14,42.01 v109.19,42.06 | R10.1 v14.6,41.27 | v98.42,32.38 97.7,31.66 C42.1 C41.1 | v101.27,34.26 101.87,33.66 R7_H.2 | JP3.2 80.61,12.66 JP2.2 | C15.2 38.56,35.09 v38.46,35.19 38.36,35.09 C13.2 36.62,34.84 PS1.4 | v40.06,8.04 39.91,7.88 C33.2 C32.2 34.98,8.96 U8.2 | U7.2 35.79,20.36 C19.2 C20.2 38.91,20.13 v40.16,20.13
  Top 0.406: JP6.1 v111.38,9.94 v111.38,9.95
  Route2/GND 0.254: 35.46,28.84 v35.46,28.03 35.46,21.05 35.56,20.95 39.34,20.95 v40.16,20.13 36.61,16.58 v35.12,16.58 34.93,16.39 34.93,8.89 35.78,8.04 v40.06,8.04 40.23,8.04 41.91,6.35 41.91,1.9 42.55,1.27 54.74,1.27 U$2.GND 56.52,3.05 56.52,5.71 59.84,9.04 v60.64,9.04 | 35.46,28.84 v38.46,31.84 38.66,31.63 40.96,31.63 41.76,32.44 v41.76,35.13 41.76,42.7 41.27,43.18 31.75,43.18 | v60.66,24.69 60.66,19.19 | 60.66,19.19 v59.37,19.19 50.02,19.19 49.53,19.68 | v46.03,9.14 v46.03,15.34 49.53,18.84 49.53,19.68 | v60.64,9.04 v60.64,14.74 60.64,19.16 60.66,19.19 | v86.06,44.06 86.06,43.26 84.67,41.86 84.67,36.76 85.97,35.46 v85.97,34.16 88.17,31.96 | 53.87,46.79 v50.66,43.59 48.66,43.59 48.27,43.19 48.27,38.69 v48.37,38.59 48.37,35.39 v48.47,35.29 48.47,30.29 v48.27,30.09 48.27,26.86 v48.24,26.84 49.53,25.55 49.53,19.68 | 88.17,31.96 v90.77,31.96 93.06,34.26 97.09,34.26 | v109.19,42.06 102.28,42.06 101.19,40.96 101.19,38.46 97.03,34.31 | 97.03,34.31 96.78,34.06 | v101.27,34.26 100.33,34.26 | 100.33,34.26 97.09,34.26 | 97.09,34.26 97.03,34.31 | 31.75,43.18 32.38,43.81 32.38,48.26 33.66,49.53 40.51,49.53 U$2.GND_4 | 31.75,43.18 27.3,43.18 25.4,41.27 v18.42,41.27 v14.6,41.27 | v66.27,22.79 66.27,25.62 67.95,27.3 69.2,27.3 70.47,28.58 v70.47,29.99 v70.47,33.19 70.47,39.69 66.27,43.89 66.06,43.89 65.66,44.29 64.66,44.29 64.27,44.69 63.16,44.69 v62.77,44.29 61.66,43.18 60.33,43.18 59.62,43.89 v59.62,44.64 | v98.42,32.38 98.45,32.38 100.33,34.26 | v60.64,9.04 71.12,9.04 | 71.12,9.04 80.12,9.04 80.12,12.18 JP2.2 | 71.12,9.04 GND.TP 71.75,2.54 v73.66,0.63 | 88.17,31.96 88.17,29.1 88.92,28.35 v88.92,21.62 88.9,21.61 88.9,20.32 88.9,18.41 88.9,17.78 88.9,11.92 85.72,11.92 85.72,10.79 83.82,8.89 81.28,8.89 81.28,12.07 JP2.2
  Route2/GND 0.254: 109.59,11.8 109.47,11.92 109.22,11.92 109.22,12.07 JP4.1 | 109.59,11.8 111.38,10.02 v111.38,9.95 | 109.59,11.8 109.59,18.68 IOUT-.TP | JP2.2 80.64,15.64 v80.67,15.66 | v70.67,24.98 71.47,25.78 75.82,25.78 77.47,24.13 81.28,24.13 81.79,24.64 U$2.GND_5 | v33.02,36.2 v33.02,29.21 | v33.02,29.21 v33.02,5.71 v33.02,0.63 | v33.02,29.21 35.09,29.21 35.46,28.84
  Route2/GND 0.406: GND10.TP 88.9,18.41 | IOUT-.TP 88.9,20.32 88.9,17.78
  Bottom 0.254: v38.46,31.84 v38.46,35.19
  pour Route2/GND (isolate 0.305): 47.94,19.99 71.36,19.99 71.36,45.69 47.94,45.69
  pour Route2/GND (isolate 0.305): 88.27,45.72 88.09,31.16 111.78,31.16 111.76,45.72
  pour Route2/GND: 74.3,-0.64 74.3,55.24 70.48,55.24 41.91,55.24 41.91,-0.64
  pour Route2/GND: 42.55,55.24 0,55.24 0,40.64 42.55,40.64
  pour Route2/GND: 79.38,45.72 106.68,45.72 106.68,-3.18 79.38,-1.27
  pour Bottom: 32.38,40.64 45.09,40.64 45.09,-0.64 32.38,-0.64
  pour Route2/GND: 32.38,40.64 42.55,40.64 42.55,0 32.38,0
  pour Top: 32.38,36.83 32.38,5.08 48.9,5.08 48.9,36.83
  pour Top: 0,40.64 0,53.98 74.3,53.98 74.3,0 32.38,0 32.38,40.64
  pour Top: 79.38,0 79.38,45.72 114.3,45.72 114.3,0
  pour Bottom: 0,54.61 74.3,54.61 74.3,0 32.38,0 32.38,40.64 0,40.64
GND_ISO_INIT  (via drill 0.38)
  Top 0.254: v19.16,35.78 19.06,35.78 | PS1.7 19.5,32.3 v19.16,32.63 | L2.1 19.11,35.84 v19.16,35.78 | PS1.5 21.91,34.84 C25.2 20.96,35.78 v19.16,35.78
  Bottom 0.254: v19.16,32.63 v19.16,35.78
GND_ISO_TRIG  (via drill 0.38)
  Top 0.254: JP5.10 JP5.9 8.83,13.91 4.5,13.91 3.17,15.24 3.17,16.25 DSUB3.9 | v21.96,28.03 22.02,27.98 U7.9 U7.10 | v20.46,16.54 20.51,16.58 U8.9 U8.10 | v18.8,22.14 18.66,22 C30.2 C29.2 21.34,20.36 U7.15 | L2.2 13.91,35.84 C24.2 13.61,35.84 v11.76,35.84 | U8.15 21.94,8.96 C16.2 C17.2 16.61,7.98 v16.36,8.23
  Route2/GND 0.254: 16.36,12.43 v16.36,8.23 13.84,5.71 v12.06,5.71 v0.64,5.71 | 16.36,12.43 v20.46,16.54 20.46,20.48 v18.8,22.14 18.8,24.88 v21.96,28.03 | 16.36,12.43 16.36,12.85 JP5.10 | v11.76,35.84 9.8,35.84 | v8.89,36.2 8.89,28.58 9.43,28.03 v21.96,28.03 | v15.24,29.21 13.97,29.21 13.33,29.84 v13.97,29.84 v13.97,31.75 10.79,31.75 10.16,32.38 10.16,34.92 9.8,35.28 9.8,35.84 | v8.89,36.2 v0.64,36.2 | v8.89,36.2 9.44,36.2 9.8,35.84 | v24.13,5.71 23.5,6.35 v23.5,17.78 23.5,26.5 v21.96,28.03
  pour Top: 0,36.83 24.77,36.83 24.77,5.08 0,5.08
  pour Bottom: 0,36.83 24.77,36.83 24.77,5.08 0,5.08
  pour Route2/GND: 0,36.83 24.77,36.83 24.77,5.08 0,5.08
I/O_UPDATE  (via drill 0.38)
  Top 0.254: U1.1 63.32,26.63 v63.37,26.59 | U$2.18 92.84,49.53 82.55,49.53 81.92,48.9 75.56,48.9 v74.3,47.62
  Bottom 0.254: v63.37,26.59 63.5,26.73 63.5,40.01 64.13,40.64 68.58,40.64 69.22,41.27 69.22,46.99 69.85,47.62 v74.3,47.62
IND_EX_1  (via drill 0.38)
  Top 0.254: U8.4 38.17,11.5 v39.37,12.7
  Route2/GND 0.254: v39.37,12.7 39.37,14.61 41.27,16.51 41.27,28.58 44.45,31.75 44.45,47.62 45.09,48.26 74.3,48.26 75.56,49.53 85.22,49.53 U$2.15
IND_EX_1_ISO  (via drill 0.38)
  Top 0.254: DSUB3.6 9.12,25.03 10.65,23.5 JP5.3 | U8.13 23.81,11.54 v19.36,11.54
  Bottom 0.254: v19.36,11.54 18.31,11.54 15.88,13.97 15.88,22.41 13.46,24.82 11.85,24.82 10.79,23.75 JP5.3
IND_EX_2  (via drill 0.38)
  Top 0.254: U8.5 37.54,12.77 v38.1,13.34
  Bottom 0.254: v38.1,13.34 41.27,16.51 41.27,28.58 44.45,31.75 44.45,47.62 45.09,48.26 64.13,48.26 65.41,49.53 82.68,49.53 U$2.14
IND_EX_2_ISO  (via drill 0.38)
  Top 0.254: U8.12 19.43,12.77 v19.36,12.84 | DSUB3.7 2.43,22.29 2.43,22.34 1.27,23.5 1.27,25.07 3.81,27.62 11.75,27.62 JP5.2
  Bottom 0.254: v19.36,12.84 19.36,12.88 18.87,12.88 16.51,15.24 16.51,22.86 JP5.2
IND_EX_3
  Top 0.254: 36.27,14.04 U8.6 37.54,14.04 41.27,17.78 41.27,28.58 44.45,31.75 44.45,48.26 45.09,48.9 63.5,48.9 64.13,49.53 72.52,49.53 U$2.2
IND_EX_3_ISO  (via drill 0.38)
  Top 0.254: U8.11 20.96,14.04 20.95,14.04 v20.26,14.04
  Bottom 0.254: v20.26,14.04 19.26,14.04 17.14,16.15 17.14,24.23 13.87,27.52 12.01,27.52 10.79,26.29 JP5.1 9.21,27.62 4.12,27.62 2.54,26.04 2.54,20.73 DSUB3.8
IND_FREQ  (via drill 0.38)
  Top 0.254: U8.3 38.8,10.23 v40.01,11.43
  Route15/VCC 0.254: v40.01,11.43 40.01,15.24 41.27,16.51 41.27,28.58 44.45,31.75 44.45,47.62 45.09,48.26 74.3,48.26 75.56,49.53 87.76,49.53 U$2.16
IND_FREQ_ISO  (via drill 0.38)
  Top 0.254: U8.14 v19.56,10.23
  Bottom 0.254: v19.56,10.23 17.75,10.23 14.63,13.36 | JP5.4 15.24,21.59 15.24,13.97 14.63,13.36 | DSUB3.5 7.68,14.02 13.97,14.02 14.63,13.36
IND_START  (via drill 0.38)
  Top 0.254: U7.5 36.87,24.17 v37.47,24.77
  Bottom 0.254: v37.47,24.77 37.47,26.04 43.81,32.38 43.81,48.26 44.45,48.9 63.63,48.9 65.91,51.18 U$2.5
IND_START_ISO
  Top 0.254: U7.12 16.55,24.17 JP5.6
  Bottom 0.254: JP5.6 13.33,20.82 14.56,19.59 14.56,18.02 13.69,17.14 8.89,17.14 8.25,17.78 8.25,20.32 7.66,20.91 DSUB3.3
IND_STIM  (via drill 0.38)
  Top 0.254: U7.4 38.14,22.9 v38.73,23.5
  Route2/GND 0.254: v38.73,23.5 38.73,27.3 43.81,32.38 43.81,48.26 44.45,48.9 66.8,48.9 U$2.4
IND_STIM_ISO
  Top 0.254: U7.13 20.92,22.9 20.32,23.5 17.45,23.5 13.76,19.82 12.19,19.82 JP5.7
  Bottom 0.254: DSUB3.2 8.09,23.66 8.89,22.86 8.89,19.05 9.53,18.41 JP5.7
IND_STOP
  Top 0.254: U7.6 36.87,25.44 43.81,32.38 43.81,48.9 44.45,49.53 62.36,49.53 U$2.6
IND_STOP_ISO
  Top 0.254: U7.11 14.49,25.44 13.87,24.82 11.96,24.82 11.87,24.71 11.87,22.02 JP5.5 10.54,20.95 7.75,18.17 DSUB3.4
IND_SWITCH  (via drill 0.38)
  Top 0.254: U7.3 39.41,21.63 v40.01,22.23
  Route15/VCC 0.254: v40.01,22.23 40.01,28.58 43.81,32.38 43.81,48.26 44.45,48.9 69.34,48.9 U$2.3
IND_SWITCH_ISO
  Top 0.254: U7.14 20.92,21.63 19.69,22.86 18.42,22.86 13.97,18.41 JP5.8
  Bottom 0.254: JP5.8 13.19,18.41 11.87,19.75 11.87,22.21 10.16,22.21 9.53,22.86 9.53,26.04 9.16,26.4 DSUB3.1 7.89,26.4
IOUT
  Top 0.254: U1.21 57.96,37.4 56.37,38.99 56.37,45.57 57.15,46.35 71.12,46.35 78.11,39.37 82.67,39.37 RY_DAC.1 R4_DAC.2 86.06,40.36 RG_DAC.1
N$1  (via drill 0.38)
  Top 0.254: U1.23 56.94,36.51 v55.66,37.79 | v55.66,40.09 55.66,41.59 C2.2
  Bottom 0.254: v55.66,37.79 v55.66,40.09
N$2
  Top 0.254: U1.8 64.69,31.71 65.06,32.09 65.06,33.39 66.6,34.92 67.95,34.92 69.22,36.2 69.22,39.39 69.27,39.44 C1.2
N$3
  Top 0.254: U6.1 96.65,21.85 R1.1
N$4  (via drill 0.38)
  Top 0.254: U1.24 56.46,35.79 55.66,36.59 55.16,36.59 v54.47,37.29 | v53.97,40.49 51.98,40.49 R_SET1.2
  Bottom 0.254: v54.47,37.29 54.47,39.99 v53.97,40.49
N$5
  pour Route15/VCC: 0,36.83 24.77,36.83 24.77,5.08 0,5.08
N$6
  cutout Top: 14.6,36.83 14.6,29.84 25.4,29.84 25.4,36.83
N$7
  cutout Bottom: 14.6,36.83 14.6,29.84 25.4,29.84 25.4,36.83
N$8
  cutout Route2/GND: 14.6,36.83 14.6,29.84 25.4,29.84 25.4,36.83
N$9
  cutout Route15/VCC: 14.6,36.83 14.6,29.84 25.4,29.84 25.4,36.83
N$10
  Top 0.254: U1.12 63.32,34.24 64.97,35.89 66.86,35.89 67.67,36.69 C38.2
N$11
  Top 0.254: R2_H.2 109.91,43.76 110.49,43.18 110.49,29.48 JP1.2 JP1.4 JP1.6 110.34,20.47 IOUT+.TP
N$12
  Top 0.254: U6.2 93.62,24.38 C50.1
N$13
  Top 0.254: U2.3 70.53,20.93 R3.2
N$14
  Top 0.254: U6.4 91.09,24.25 C50.2
N$15
  cutout Top: 78.74,32.38 78.74,23.5 83.82,23.5 83.82,32.38
N$16
  cutout Bottom: 78.74,32.38 78.74,23.5 83.82,23.5 83.82,32.38
N$17
  cutout Route2/GND: 78.74,32.38 78.74,23.5 83.82,23.5 83.82,32.38
N$18
  Top 0.254: R_HG2.2 107.77,26.82 JP1.3
N$19
  cutout Route15/VCC: 78.74,32.38 78.74,23.5 83.82,23.5 83.82,32.38
N$20
  Top 0.254: R_HG3.2 107.77,24.21 JP1.5
N$21
  Top 0.254: R_HG1.2 107.79,29.31 JP1.1
PS0  (via drill 0.38)
  Top 0.254: U1.47 61.47,24.79 v61.97,24.29
  Bottom 0.254: U$2.20 96.65,48.26 69.22,48.26 68.58,47.62 68.58,41.91 67.95,41.27 63.5,41.27 62.87,40.64 62.87,27.94 61.97,27.04 v61.97,24.29
PS1  (via drill 0.38)
  Top 0.254: 61.95,26.01 U1.48 61.95,25.41 v63.06,24.29 | U$2.19 96.9,51.18 94.61,48.9 83.19,48.9 82.55,48.26 76.2,48.26 v75.56,47.62
  Bottom 0.254: v63.06,24.29 64.13,25.36 64.13,39.37 64.77,40.01 69.22,40.01 69.85,40.64 69.85,46.35 70.48,46.99 74.93,46.99 v75.56,47.62
REFCLK  (via drill 0.38)
  Top 0.254: U1.9 64.37,32.2 64.56,32.39 64.56,34.19 v65.27,34.89 | U2.5 68.69,24.95 v68.67,24.98
  Bottom 0.254: 68.67,25.54 v68.67,24.98 68.67,31.49 v65.27,34.89 68.19,37.81 CLK.TP
RESET
  Top 0.254: U1.36 55.09,26.52 53.98,25.4 45.72,25.4 45.09,26.04 45.09,47.62 45.72,48.26 64.13,48.26 64.77,48.9 73.03,48.9 73.66,49.53 74.3,49.53 74.93,49.53 81.28,49.53 81.92,50.16 81.92,52.07 82.55,52.7 100.58,52.7 U$2.21
SCLK  (via drill 0.38)
  Top 0.254: U1.40 57.96,23.67 57.15,22.86 v57.15,22.23 | SCLK.TP 75.56,20.32 76.84,21.59 76.84,25.91 U$2.SPCK
  Bottom 0.254: v57.15,22.23 58.42,20.95 71.75,20.95 72.39,21.59 72.39,24.77 73.03,25.4 76.84,25.4 77.47,26.04 77.47,27.3 78.49,28.32 U$2.SPCK
SDIO  (via drill 0.38)
  Top 0.254: U1.41 58.44,22.25 v57.15,20.95
  Bottom 0.254: U$2.MOSI 82.17,28.32 83.19,27.3 83.19,24.77 82.55,24.13 77.47,24.13 76.84,23.5 | SDIO.TP 75.56,17.78 76.84,19.05 76.84,23.5 | v57.15,20.95 57.79,20.32 72.39,20.32 73.03,20.95 73.03,24.13 73.66,24.77 75.56,24.77 76.84,23.5
SDO  (via drill 0.38)
  Top 0.254: U1.38 56.94,25.19 v56.52,24.77 | SDO.TP 74.93,26.54 U$2.MISO
  Bottom 0.254: v56.52,24.77 59.69,21.59 71.12,21.59 71.75,22.23 71.75,25.4 72.39,26.04 76.2,26.04 76.84,26.67 76.84,28.45 U$2.MISO
SW_DIN+
  Top 0.254: DSUB2.3 16.48,52.05 17.14,52.7 51.44,52.7 52.32,51.82 U$2.10
SW_DIN-
  Route15/VCC 0.254: DSUB2.7 17.86,52.15 18.42,52.7 48.9,52.7 49.78,51.82 U$2.11
SW_RESET
  Bottom 0.254: U$2.9 54.86,51.82 53.98,52.7 33.02,52.7 32.38,52.07 32.38,50.8 31.75,50.16 15.88,50.16 15.24,49.53 15.24,47.89 DSUB2.8
SW_SCLK
  Route2/GND 0.254: DSUB2.2 19.23,52.25 19.69,52.7 46.36,52.7 47.24,51.82 U$2.12
SW_SYNC
  Bottom 0.254: DSUB2.4 13.74,44.68 14.6,43.81 24.13,43.81 24.77,44.45 24.77,48.9 25.4,49.53 56.52,49.53 57.4,50.42 U$2.8
SW_TEST_1  (via drill 0.38)
  Top 0.254: DSUB2.5 10.48,44.71 R10.2 9.53,41.27 v8.25,42.55
  Route15/VCC 0.254: v8.25,42.55 23.5,42.55 24.77,43.81 24.77,48.9 26.04,50.16 32.38,50.16 33.02,49.53 59.05,49.53 60.71,51.18 U$2.7
SW_TEST_2
  Top 0.254: U$2.13 43.05,49.53 36.83,49.53 33.66,49.53 33.02,49.53 32.38,50.16 26.04,50.16 24.77,48.9 24.77,42.55 23.5,41.27 R11.2 22.54,44.66 DSUB2.1
V_ISO_INIT
  Top 0.254: PS1.8 22.31,31.03 21.59,31.75 19.05,31.75 17.41,33.39 L1.1 17.56,33.98 C25.1 21.48,33.57 PS1.6
V_ISO_TRIG  (via drill 0.38)
  Top 0.254: v18.42,16.51 18.66,16.75 C30.1 C29.1 21.77,19.09 U7.16 | 11.66,33.88 v11.43,33.66 11.76,33.98 C24.1 13.91,33.84 L1.2 | v16.46,6.13 18.21,6.13 C17.1 C16.1 21.03,6.35 22.23,6.35 23.57,7.69 U8.16
  Route15/VCC 0.254: v16.46,6.13 17.56,7.23 17.56,15.66 v18.42,16.51 | v18.42,16.51 18.64,16.51 | v18.42,16.51 18.42,18.41 15.24,21.59 15.24,27.94 14.6,28.58 12.06,28.58 11.43,29.21 v11.43,33.66
VBAT+
  Top 0.254: S3.6 89.98,3.36 85.72,7.62 82.88,7.62 JP3.1 82.61,12.12 JP2.1
VBAT-
  Top 0.254: S3.3 99.25,3.36 103.5,7.62 107.06,7.62 JP6.2 107.31,8.19 JP4.2
VIN_NEG  (via drill 0.38)
  Top 0.254: v94.61,29.21 95.25,29.84 95.25,31.41 C42.2 C41.2 95,35.95 95.25,36.2 97.03,36.2 97.59,36.75 IC3.4
  Bottom 0.254: S3.2 96.34,5.9 95.89,6.35 95.89,27.94 v94.61,29.21 88.9,23.5 VIN_NEG.TP
  pour Bottom: 79.38,45.72 114.3,45.72 114.3,-1.27 79.38,-1.27
VIN_POS  (via drill 0.38)
  Top 0.254: C46.1 47.62,11.01 IC1.3 50.71,10.16 52.43,8.45 57.13,8.45 59.52,10.84 62.07,10.84 C48.1 64.53,10.74 IC2.3 64.84,10.43 64.84,8.19 v65.41,7.62 | U6.8 96.37,16.92 R1.2 98.32,18.27 v98.32,16.32 | C39.2 C40.2 109.34,40.31 v109.48,40.46 | 105.04,39.96 C39.2 | IC3.8 102.53,39.03 103.5,40.01 105.08,40.01 C39.2
  Route15/VCC 0.254: 109.34,40.31 v109.48,40.46 102.06,40.46 99.7,38.1 99.7,17.7 v98.32,16.32 | 98.42,16.22 v98.32,16.32 | v98.32,16.32 98.32,15.69 94.61,11.98 94.61,7.62 92.89,5.9 S3.5 67.12,5.9 v65.41,7.62 | VIN_POS.TP 87.63,20.95 88.27,20.32 94.33,20.32 v98.32,16.32
  pour Route15/VCC: 79.38,45.72 114.3,45.72 114.3,-0.64 79.38,-0.64
~CS  (via drill 0.38)
  Top 0.254: U1.39 57.45,24.43 56.52,23.5 v48.26,23.5
  Bottom 0.254: U$2.17 89.66,48.9 66.04,48.9 64.77,47.62 45.72,47.62 45.09,46.99 45.09,26.67 v48.26,23.5
~IOUT
  Top 0.254: U1.20 58.44,37.81 56.97,39.29 56.97,44.9 57.79,45.72 70.48,45.72 77.47,38.73 82.69,38.73 RX_DAC.1 R1_DAC.2 86.03,37.73 R2_DAC.2

### Text on the board
tPlace: gnd | 9 | 8 | 7 | 6 | 5 | 4 | 3 | 2 | 1 | 13 | 12 | 11 | 10 | Switch / Network | Batt- | Batt+ | Batt- | Batt+ | HCP PWR SEL | Current uA / 1: 250 / 2: 100 / 3: 50 | EEG / Triggers | ARD | ARD | +3V3 | -3V3 | BATT | BATT | 3v3 | 5V | gnd
tNames: GND